# EAGLE schematic icyradio-exp-mmw-int (EAGLE 9.6.2)
CREVISION: 1; DESIGNER: Joao Silva; SERIES: ATC520L

## Sheet 1 of 11: MCU
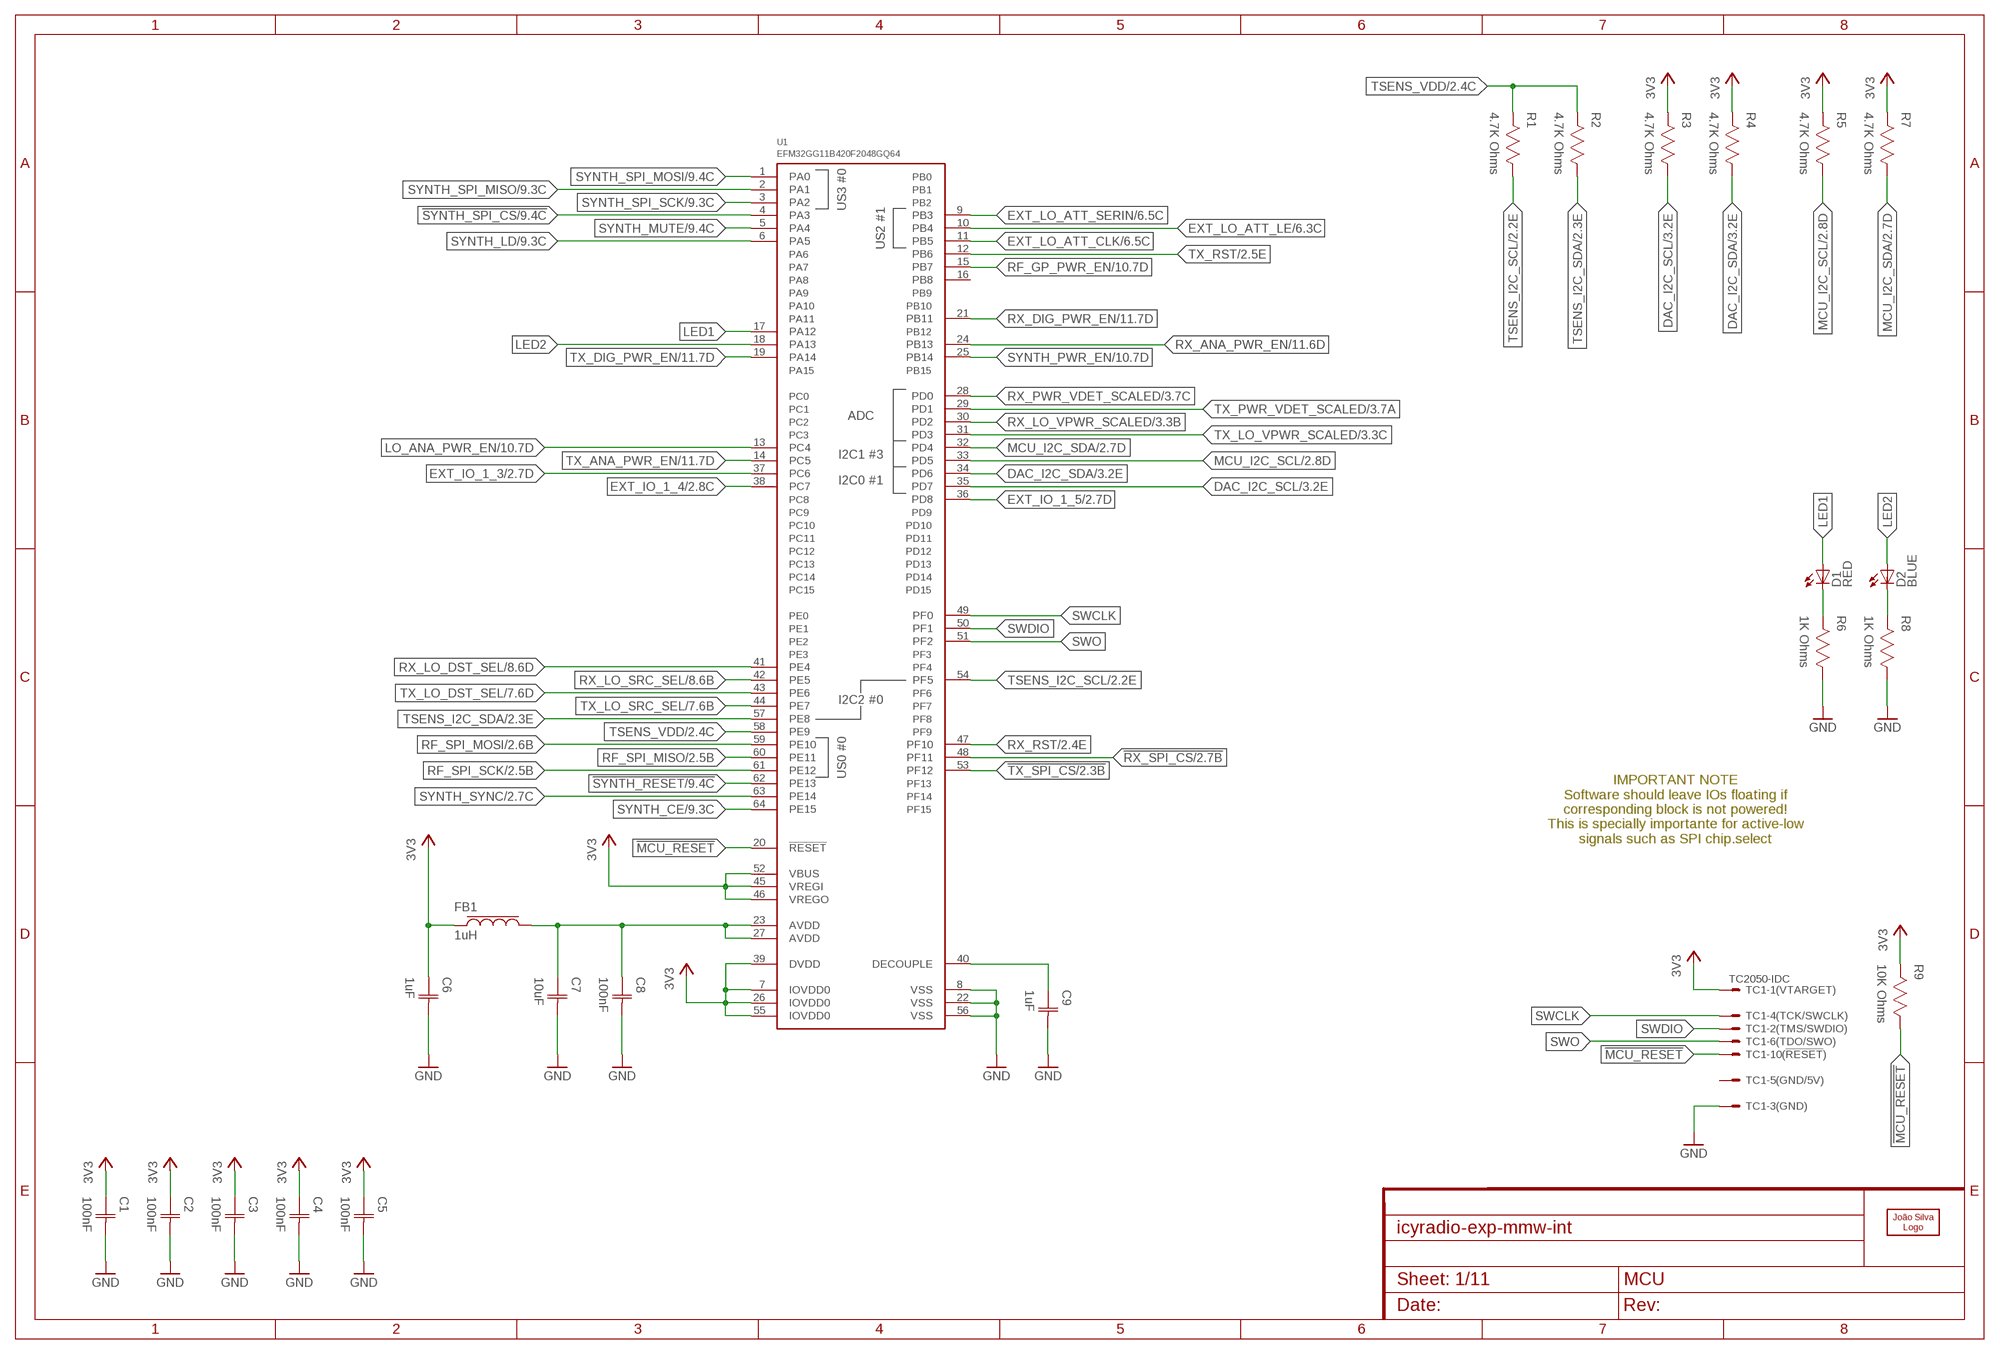
[diagram p0: schematic, sheet 1]

### Parts
C1  100nF  CAPACITOR-0402  [CAP0402]
C2  100nF  CAPACITOR-0402  [CAP0402]
C3  100nF  CAPACITOR-0402  [CAP0402]
C4  100nF  CAPACITOR-0402  [CAP0402]
C5  100nF  CAPACITOR-0402  [CAP0402]
C6  1uF  CAPACITOR-0402  [CAP0402]
C7  10uF  CAPACITOR-0402  [CAP0402]
C8  100nF  CAPACITOR-0402  [CAP0402]
C9  1uF  CAPACITOR-0402  [CAP0402]
D1  LED0603  [0603]
D2  LED0603  [0603]
FB1  1uH  FERRITE-0603  [IND0603]
LOGO1  JSILVA-5MM  [JSILVA_5MM]
R1  4.7K Ohms  RESISTOR-0402  [RES0402]
R2  4.7K Ohms  RESISTOR-0402  [RES0402]
R3  4.7K Ohms  RESISTOR-0402  [RES0402]
R4  4.7K Ohms  RESISTOR-0402  [RES0402]
R5  4.7K Ohms  RESISTOR-0402  [RES0402]
R6  1K Ohms  RESISTOR-0402  [RES0402]
R7  4.7K Ohms  RESISTOR-0402  [RES0402]
R8  1K Ohms  RESISTOR-0402  [RES0402]
R9  10K Ohms  RESISTOR-0402  [RES0402]
TC1  TC2050-IDC  [TC2050-IDC]
U1  EFM32GG11B420F2048GQ64  [QFP64]

### Nets
3V3: C1.1(C1) C2.1(C1) C3.1(C1) C4.1(C1) C5.1(C1) C6.1(C1) FB1.1 R3.2 R4.2 R5.2 R7.2 R9.2 TC1.1 U1.7(IOVDD0) U1.26(IOVDD0) U1.39(DVDD) U1.45(VREGI) U1.46(VREGO) U1.52(VBUS) U1.55(IOVDD0) ; also sheet 2,3,11
!MCU_RESET: R9.1 TC1.10 U1.20(!RESET)
!RX_SPI_CS: U1.48(PF11) ; also sheet 2
!SYNTH_RESET: U1.62(PE13) ; also sheet 9
!SYNTH_SPI_CS: U1.4(PA3) ; also sheet 9
!TX_SPI_CS: U1.53(PF12) ; also sheet 2
DAC_I2C_SCL: R3.1 U1.35(PD7) ; also sheet 3
DAC_I2C_SDA: R4.1 U1.34(PD6) ; also sheet 3
EXT_IO_1_3: U1.37(PC6) ; also sheet 2
EXT_IO_1_4: U1.38(PC7) ; also sheet 2
EXT_IO_1_5: U1.36(PD8) ; also sheet 2
EXT_LO_ATT_CLK: U1.11(PB5) ; also sheet 6
EXT_LO_ATT_LE: U1.10(PB4) ; also sheet 6
EXT_LO_ATT_SERIN: U1.9(PB3) ; also sheet 6
GND: C1.2(C2) C2.2(C2) C3.2(C2) C4.2(C2) C5.2(C2) C6.2(C2) C7.2(C2) C8.2(C2) C9.2(C2) R6.1 R8.1 TC1.3 U1.8(VSS) U1.22(VSS) U1.56(VSS) ; also sheet 2,3,4,5,6,7,8,9,10,11
LED1: D1.A U1.17(PA12)
LED2: D2.A U1.18(PA13)
LO_ANA_PWR_EN: U1.13(PC4) ; also sheet 10
MCU_AVDD: C7.1(C1) C8.1(C1) FB1.2 U1.23(AVDD) U1.27(AVDD)
MCU_I2C_SCL: R5.1 U1.33(PD5) ; also sheet 2
MCU_I2C_SDA: R7.1 U1.32(PD4) ; also sheet 2
N$1: C9.1(C1) U1.40(DECOUPLE)
N$7: D1.C R6.2
N$16: D2.C R8.2
RF_GP_PWR_EN: U1.15(PB7) ; also sheet 10
RF_SPI_MISO: U1.60(PE11) ; also sheet 2
RF_SPI_MOSI: U1.59(PE10) ; also sheet 2
RF_SPI_SCK: U1.61(PE12) ; also sheet 2
RX_ANA_PWR_EN: U1.24(PB13) ; also sheet 11
RX_DIG_PWR_EN: U1.21(PB11) ; also sheet 11
RX_LO_DST_SEL: U1.41(PE4) ; also sheet 8
RX_LO_SRC_SEL: U1.42(PE5) ; also sheet 8
RX_LO_VPWR_SCALED: U1.30(PD2) ; also sheet 3
RX_PWR_VDET_SCALED: U1.28(PD0) ; also sheet 3
RX_RST: U1.47(PF10) ; also sheet 2
SWCLK: TC1.4 U1.49(PF0)
SWDIO: TC1.2 U1.50(PF1)
SWO: TC1.6 U1.51(PF2)
SYNTH_CE: U1.64(PE15) ; also sheet 9
SYNTH_LD: U1.6(PA5) ; also sheet 9
SYNTH_MUTE: U1.5(PA4) ; also sheet 9
SYNTH_PWR_EN: U1.25(PB14) ; also sheet 10
SYNTH_SPI_MISO: U1.2(PA1) ; also sheet 9
SYNTH_SPI_MOSI: U1.1(PA0) ; also sheet 9
SYNTH_SPI_SCK: U1.3(PA2) ; also sheet 9
SYNTH_SYNC: U1.63(PE14) ; also sheet 2,9
TSENS_I2C_SCL: R1.1 U1.54(PF5) ; also sheet 2
TSENS_I2C_SDA: R2.1 U1.57(PE8) ; also sheet 2
TSENS_VDD: R1.2 R2.2 U1.58(PE9) ; also sheet 2
TX_ANA_PWR_EN: U1.14(PC5) ; also sheet 11
TX_DIG_PWR_EN: U1.19(PA14) ; also sheet 11
TX_LO_DST_SEL: U1.43(PE6) ; also sheet 7
TX_LO_SRC_SEL: U1.44(PE7) ; also sheet 7
TX_LO_VPWR_SCALED: U1.31(PD3) ; also sheet 3
TX_PWR_VDET_SCALED: U1.29(PD1) ; also sheet 3
TX_RST: U1.12(PB6) ; also sheet 2
Unconnected: TC1.5 TC1.7 TC1.8 TC1.9 U1.16(PB8)

### Notes on the sheet
- US3 #0
- US2 #1
- ADC
- I2C1 #3
- I2C0 #1
- I2C2 #0
- US0 #0
- IMPORTANT NOTE
  Software should leave IOs floating if
  corresponding block is not powered!
  This is specially importante for active-low
  signals such as SPI chip.select

## Sheet 2 of 11: Misc Digital
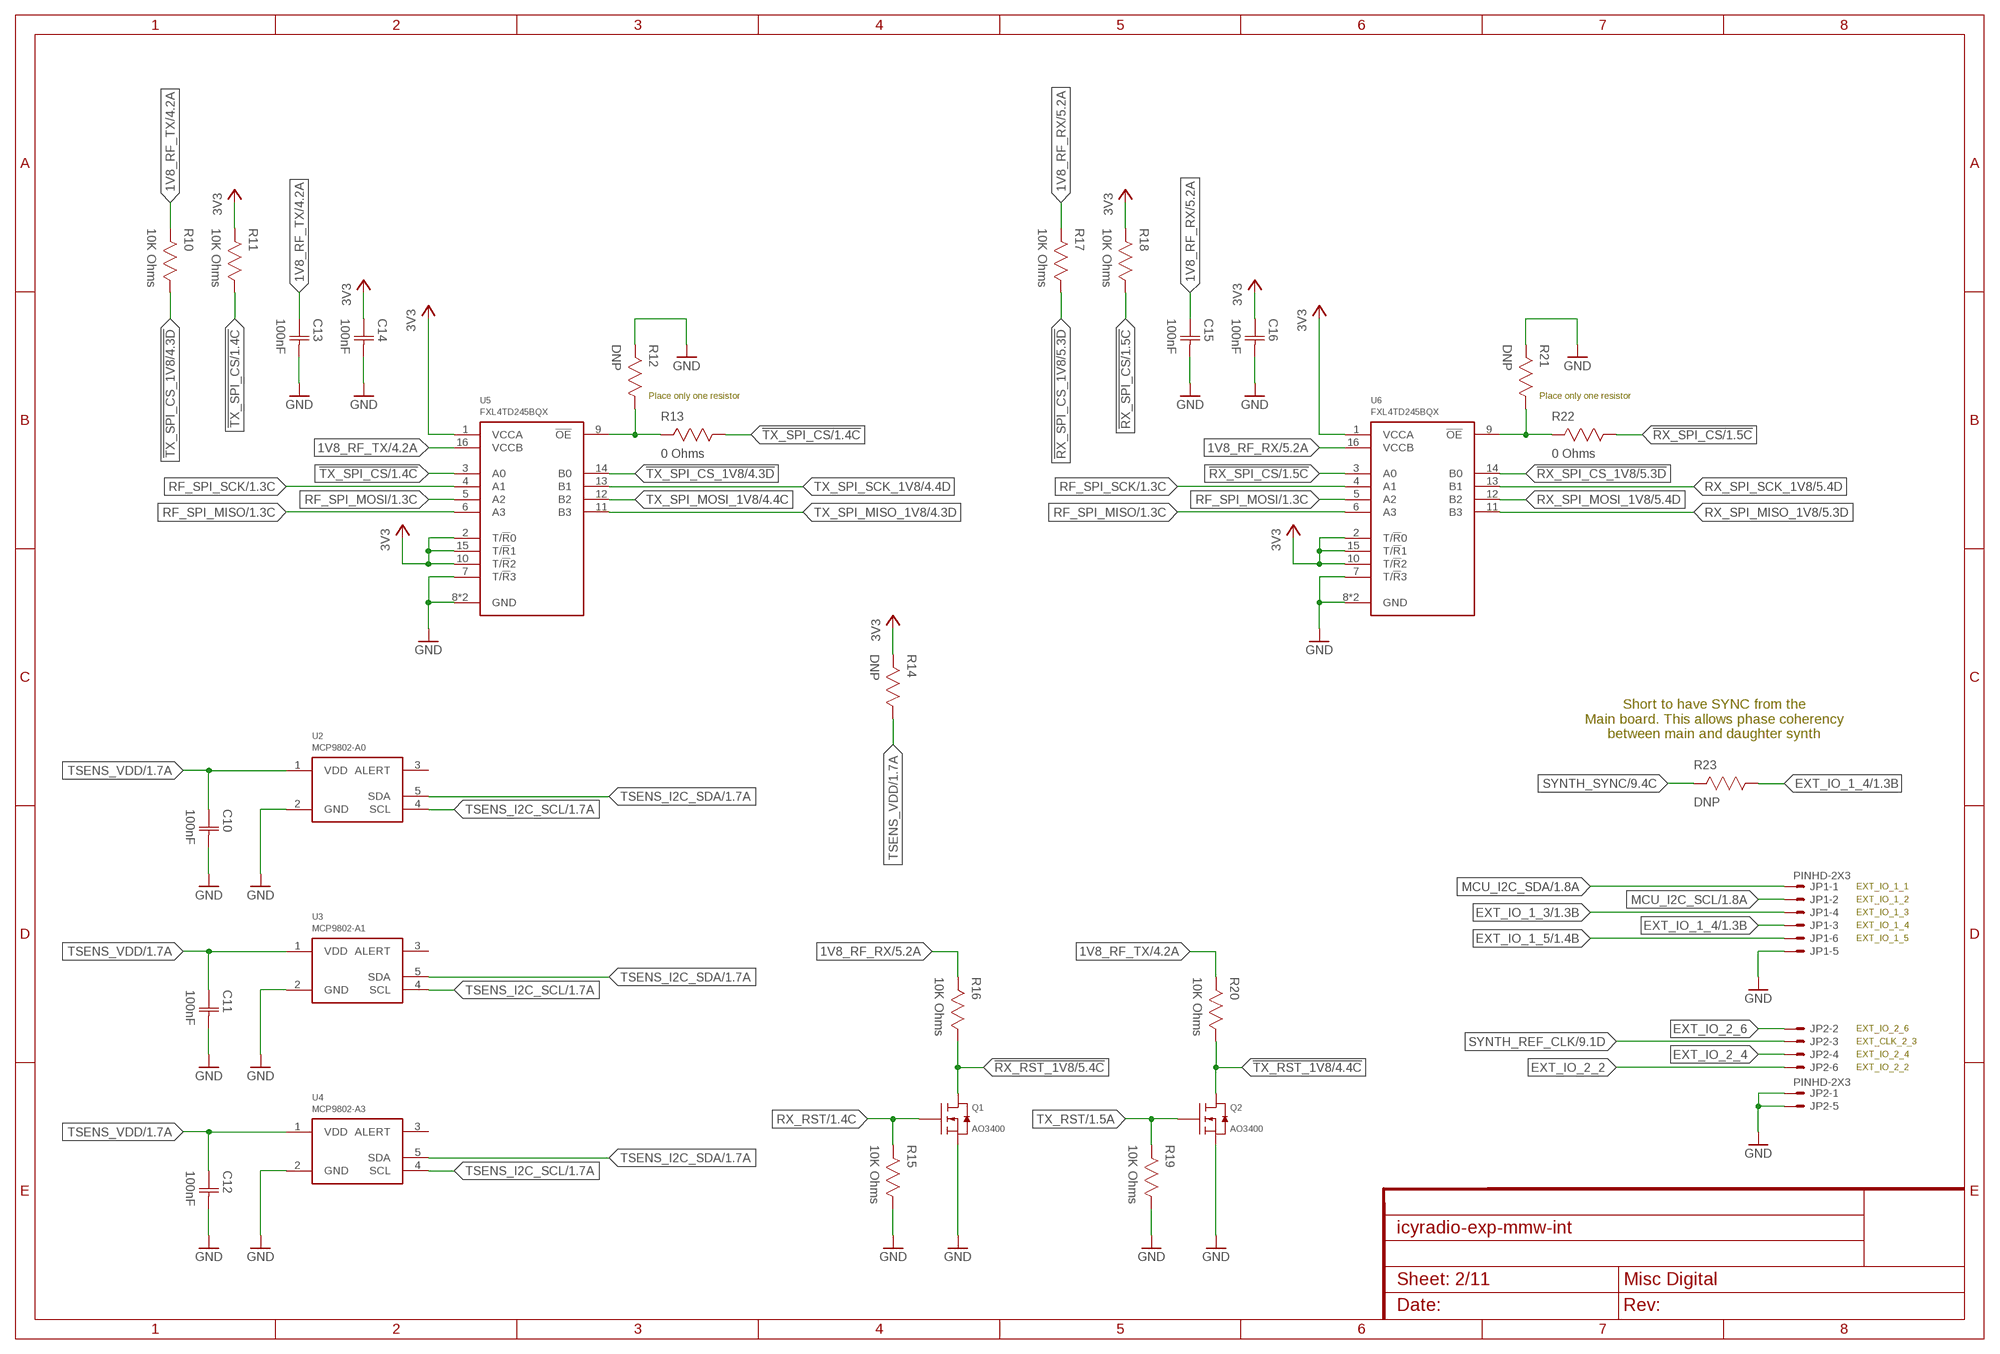
[diagram p1: schematic, sheet 2]

### Parts
C10  100nF  CAPACITOR-0402  [CAP0402]
C11  100nF  CAPACITOR-0402  [CAP0402]
C12  100nF  CAPACITOR-0402  [CAP0402]
C13  100nF  CAPACITOR-0402  [CAP0402]
C14  100nF  CAPACITOR-0402  [CAP0402]
C15  100nF  CAPACITOR-0402  [CAP0402]
C16  100nF  CAPACITOR-0402  [CAP0402]
JP1  PINHD-2X3  [2X03]
JP2  PINHD-2X3  [2X03]
Q1  AO3400  [SOT23]
Q2  AO3400  [SOT23]
R10  10K Ohms  RESISTOR-0402  [RES0402]
R11  10K Ohms  RESISTOR-0402  [RES0402]
R12  DNP  RESISTOR-0402  [RES0402]
R13  0 Ohms  RESISTOR-0402  [RES0402]
R14  DNP  RESISTOR-0402  [RES0402]
R15  10K Ohms  RESISTOR-0402  [RES0402]
R16  10K Ohms  RESISTOR-0402  [RES0402]
R17  10K Ohms  RESISTOR-0402  [RES0402]
R18  10K Ohms  RESISTOR-0402  [RES0402]
R19  10K Ohms  RESISTOR-0402  [RES0402]
R20  10K Ohms  RESISTOR-0402  [RES0402]
R21  DNP  RESISTOR-0402  [RES0402]
R22  0 Ohms  RESISTOR-0402  [RES0402]
R23  DNP  RESISTOR-0402  [RES0402]
U2  MCP9802-A0  [SOT23-5]
U3  MCP9802-A1  [SOT23-5]
U4  MCP9802-A3  [SOT23-5]
U5  FXL4TD245BQX  [DQFN16]
U6  FXL4TD245BQX  [DQFN16]

### Nets
1V8_RF_RX: C15.1(C1) R16.2 R17.2 U6.16(VCCB) ; also sheet 5,11
1V8_RF_TX: C13.1(C1) R10.2 R20.2 U5.16(VCCB) ; also sheet 4,11
3V3: C14.1(C1) C16.1(C1) R11.2 R14.2 R18.2 U5.1(VCCA) U5.2(T/!R!0) U5.10(T/!R!2) U5.15(T/!R!1) U6.1(VCCA) U6.2(T/!R!0) U6.10(T/!R!2) U6.15(T/!R!1) ; also sheet 1,3,11
!RX_RST_1V8: Q1.3(D) R16.1 ; also sheet 5
!RX_SPI_CS: R18.1 R22.1 U6.3(A0) ; also sheet 1
!RX_SPI_CS_1V8: R17.1 U6.14(B0) ; also sheet 5
!RX_SPI_OE: R21.1 R22.2 U6.9(!OE)
!TX_RST_1V8: Q2.3(D) R20.1 ; also sheet 4
!TX_SPI_CS: R11.1 R13.1 U5.3(A0) ; also sheet 1
!TX_SPI_CS_1V8: R10.1 U5.14(B0) ; also sheet 4
!TX_SPI_OE: R12.1 R13.2 U5.9(!OE)
EXT_IO_1_3: JP1.4 ; also sheet 1
EXT_IO_1_4: JP1.3 R23.1 ; also sheet 1
EXT_IO_1_5: JP1.6 ; also sheet 1
EXT_IO_2_2: JP2.6
EXT_IO_2_4: JP2.4
EXT_IO_2_6: JP2.2
GND: C10.2(C2) C11.2(C2) C12.2(C2) C13.2(C2) C14.2(C2) C15.2(C2) C16.2(C2) JP1.5 JP2.1 JP2.5 Q1.2(S) Q2.2(S) R12.2 R15.1 R19.1 R21.2 U2.2(GND) U3.2(GND) U4.2(GND) U5.7(T/!R!3) U5.8(GND) U5.17(GND) U6.7(T/!R!3) U6.8(GND) U6.17(GND) ; also sheet 1,3,4,5,6,7,8,9,10,11
MCU_I2C_SCL: JP1.2 ; also sheet 1
MCU_I2C_SDA: JP1.1 ; also sheet 1
RF_SPI_MISO: U5.6(A3) U6.6(A3) ; also sheet 1
RF_SPI_MOSI: U5.5(A2) U6.5(A2) ; also sheet 1
RF_SPI_SCK: U5.4(A1) U6.4(A1) ; also sheet 1
RX_RST: Q1.1(G) R15.2 ; also sheet 1
RX_SPI_MISO_1V8: U6.11(B3) ; also sheet 5
RX_SPI_MOSI_1V8: U6.12(B2) ; also sheet 5
RX_SPI_SCK_1V8: U6.13(B1) ; also sheet 5
SYNTH_REF_CLK: JP2.3 ; also sheet 9
SYNTH_SYNC: R23.2 ; also sheet 1,9
TSENS_I2C_SCL: U2.4(SCL) U3.4(SCL) U4.4(SCL) ; also sheet 1
TSENS_I2C_SDA: U2.5(SDA) U3.5(SDA) U4.5(SDA) ; also sheet 1
TSENS_VDD: C10.1(C1) C11.1(C1) C12.1(C1) R14.1 U2.1(VDD) U3.1(VDD) U4.1(VDD) ; also sheet 1
TX_RST: Q2.1(G) R19.2 ; also sheet 1
TX_SPI_MISO_1V8: U5.11(B3) ; also sheet 4
TX_SPI_MOSI_1V8: U5.12(B2) ; also sheet 4
TX_SPI_SCK_1V8: U5.13(B1) ; also sheet 4
Unconnected: U2.3(ALERT) U3.3(ALERT) U4.3(ALERT)

### Notes on the sheet
- Place only one resistor | Place only one resistor
- Short to have SYNC from the
  Main board. This allows phase coherency
  between main and daughter synth
- EXT_IO_1_1
- EXT_IO_1_2
- EXT_IO_1_3
- EXT_IO_1_4
- EXT_IO_1_5
- EXT_IO_2_6
- EXT_CLK_2_3
- EXT_IO_2_4
- EXT_IO_2_2

## Sheet 3 of 11: Misc Analog
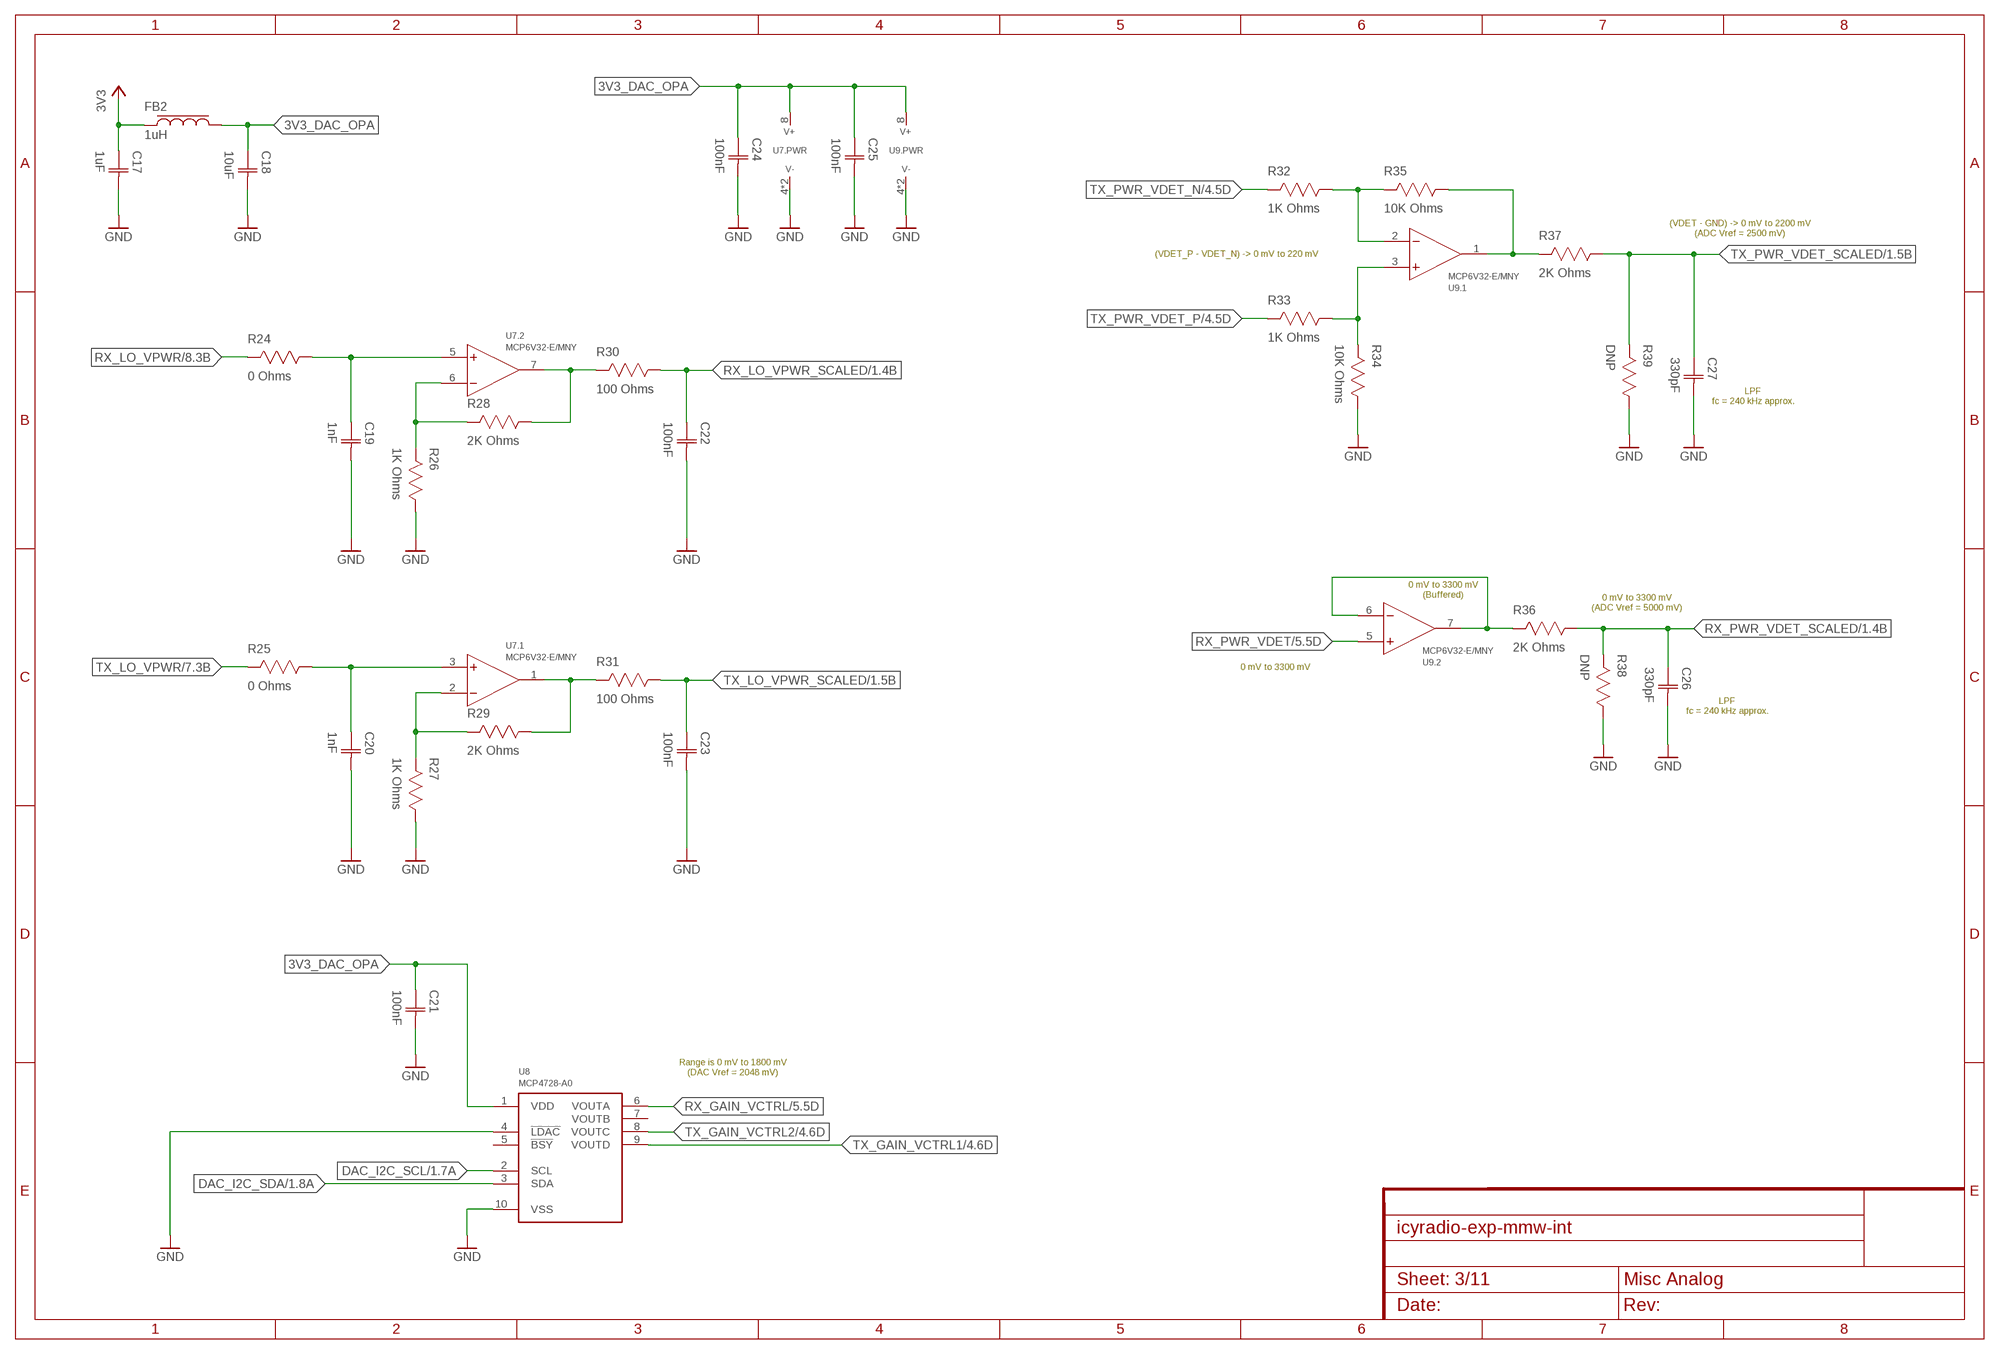
[diagram p2: schematic, sheet 3]

### Parts
C17  1uF  CAPACITOR-0402  [CAP0402]
C18  10uF  CAPACITOR-0402  [CAP0402]
C19  1nF  CAPACITOR-0402  [CAP0402]
C20  1nF  CAPACITOR-0402  [CAP0402]
C21  100nF  CAPACITOR-0402  [CAP0402]
C22  100nF  CAPACITOR-0402  [CAP0402]
C23  100nF  CAPACITOR-0402  [CAP0402]
C24  100nF  CAPACITOR-0402  [CAP0402]
C25  100nF  CAPACITOR-0402  [CAP0402]
C26  330pF  CAPACITOR-0402  [CAP0402]
C27  330pF  CAPACITOR-0402  [CAP0402]
FB2  1uH  FERRITE-0603  [IND0603]
R24  0 Ohms  RESISTOR-0402  [RES0402]
R25  0 Ohms  RESISTOR-0402  [RES0402]
R26  1K Ohms  RESISTOR-0402  [RES0402]
R27  1K Ohms  RESISTOR-0402  [RES0402]
R28  2K Ohms  RESISTOR-0402  [RES0402]
R29  2K Ohms  RESISTOR-0402  [RES0402]
R30  100 Ohms  RESISTOR-0402  [RES0402]
R31  100 Ohms  RESISTOR-0402  [RES0402]
R32  1K Ohms  RESISTOR-0402  [RES0402]
R33  1K Ohms  RESISTOR-0402  [RES0402]
R34  10K Ohms  RESISTOR-0402  [RES0402]
R35  10K Ohms  RESISTOR-0402  [RES0402]
R36  2K Ohms  RESISTOR-0402  [RES0402]
R37  2K Ohms  RESISTOR-0402  [RES0402]
R38  DNP  RESISTOR-0402  [RES0402]
R39  DNP  RESISTOR-0402  [RES0402]
U7  MCP6V32-E/MNY  [TDFN8]
U8  MCP4728-A0  [MSOP10]
U9  MCP6V32-E/MNY  [TDFN8]

### Nets
3V3: C17.1(C1) FB2.1 ; also sheet 1,2,11
3V3_DAC_OPA: C18.1(C1) C21.1(C1) C24.1(C1) C25.1(C1) FB2.2 U7.8(.PWR:V+) U8.1(VDD) U9.8(.PWR:V+)
DAC_I2C_SCL: U8.2(SCL) ; also sheet 1
DAC_I2C_SDA: U8.3(SDA) ; also sheet 1
GND: C17.2(C2) C18.2(C2) C19.2(C2) C20.2(C2) C21.2(C2) C22.2(C2) C23.2(C2) C24.2(C2) C25.2(C2) C26.2(C2) C27.2(C2) R26.1 R27.1 R34.1 R38.1 R39.1 U7.4(.PWR:V-) U7.9(.PWR:V-) U8.4(!LDAC) U8.10(VSS) U9.4(.PWR:V-) U9.9(.PWR:V-) ; also sheet 1,2,4,5,6,7,8,9,10,11
N$4: R32.1 R35.2 U9.2(.1:-IN)
N$5: R33.1 R34.2 U9.3(.1:+IN)
N$6: R36.2 U9.6(.2:-IN) U9.7(.2:OUT)
RX_GAIN_VCTRL: U8.6(VOUTA) ; also sheet 5
RX_LO_VPWR: R24.2 ; also sheet 8
RX_LO_VPWR_AMP: R28.1 R30.2 U7.7(.2:OUT)
RX_LO_VPWR_FB: R26.2 R28.2 U7.6(.2:-IN)
RX_LO_VPWR_FLT: C19.1(C1) R24.1 U7.5(.2:+IN)
RX_LO_VPWR_SCALED: C22.1(C1) R30.1 ; also sheet 1
RX_PWR_VDET: U9.5(.2:+IN) ; also sheet 5
RX_PWR_VDET_SCALED: C26.1(C1) R36.1 R38.2 ; also sheet 1
TX_GAIN_VCTRL1: U8.9(VOUTD) ; also sheet 4
TX_GAIN_VCTRL2: U8.8(VOUTC) ; also sheet 4
TX_LO_VPWR: R25.2 ; also sheet 7
TX_LO_VPWR_AMP: R29.1 R31.2 U7.1(.1:OUT)
TX_LO_VPWR_FB: R27.2 R29.2 U7.2(.1:-IN)
TX_LO_VPWR_FLT: C20.1(C1) R25.1 U7.3(.1:+IN)
TX_LO_VPWR_SCALED: C23.1(C1) R31.1 ; also sheet 1
TX_PWR_VDET: R35.1 R37.2 U9.1(.1:OUT)
TX_PWR_VDET_N [Microstrip Diff Z50]: R32.2 ; also sheet 4
TX_PWR_VDET_P [Microstrip Diff Z50]: R33.2 ; also sheet 4
TX_PWR_VDET_SCALED: C27.1(C1) R37.1 R39.2 ; also sheet 1
Unconnected: U8.5(!BSY) U8.7(VOUTB)

### Notes on the sheet
- (VDET - GND) -> 0 mV to 2200 mV
  (ADC Vref = 2500 mV)
- (VDET_P - VDET_N) -> 0 mV to 220 mV
- LPF
  fc = 240 kHz approx.
- 0 mV to 3300 mV
  (Buffered)
- 0 mV to 3300 mV
  (ADC Vref = 5000 mV)
- 0 mV to 3300 mV
- LPF
  fc = 240 kHz approx.
- Range is 0 mV to 1800 mV
  (DAC Vref = 2048 mV)

## Sheet 4 of 11: Upconverter
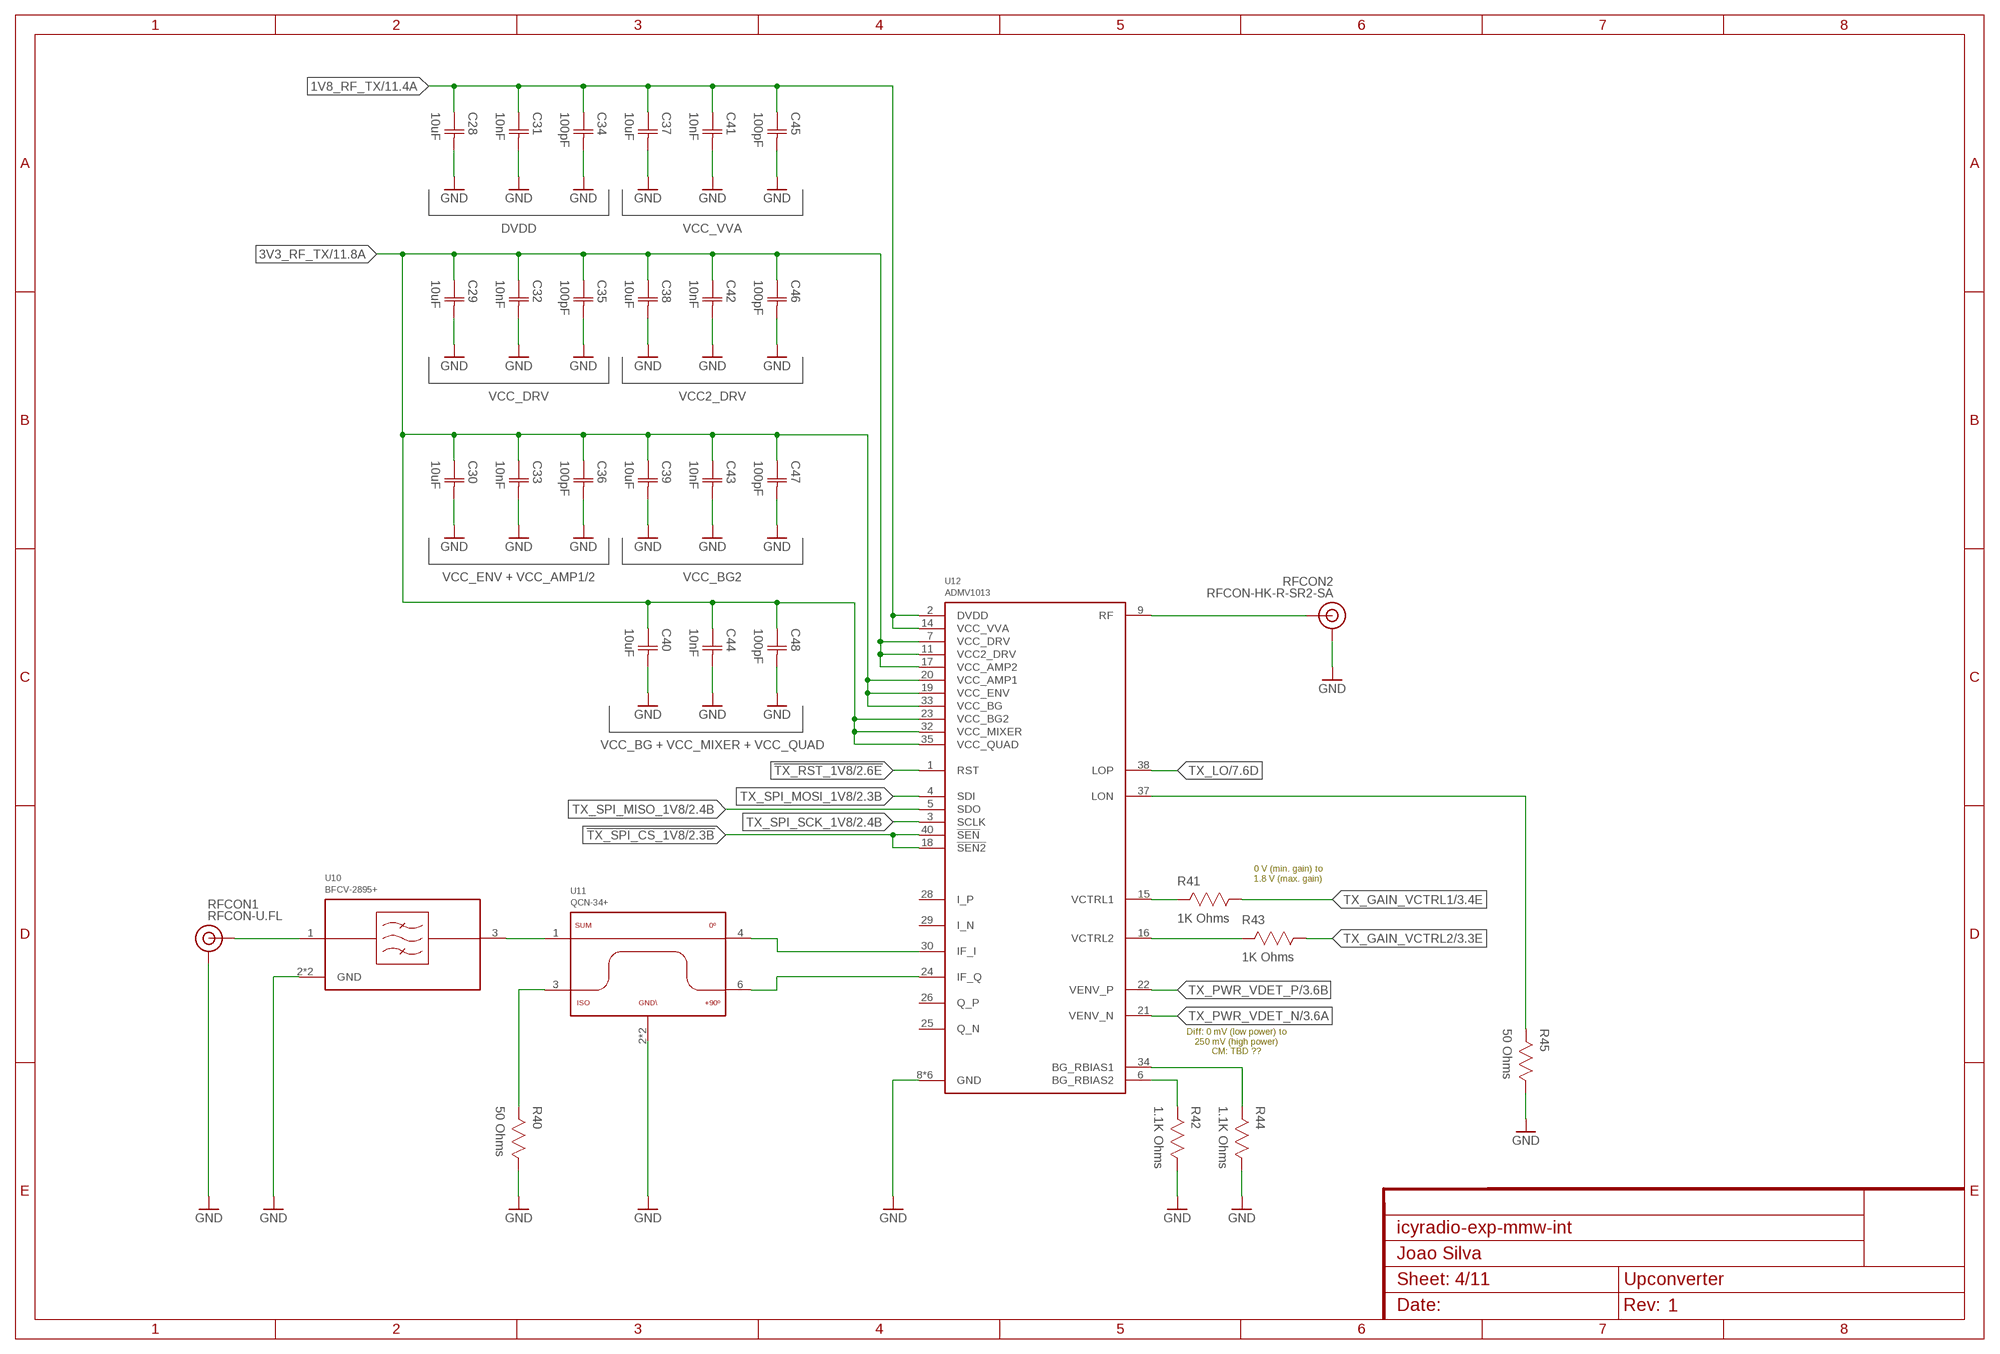
[diagram p3: schematic, sheet 4]

### Parts
C28  10uF  CAPACITOR-0402  [CAP0402]
C29  10uF  CAPACITOR-0402  [CAP0402]
C30  10uF  CAPACITOR-0402  [CAP0402]
C31  10nF  CAPACITOR-0402  [CAP0402]
C32  10nF  CAPACITOR-0402  [CAP0402]
C33  10nF  CAPACITOR-0402  [CAP0402]
C34  100pF  CAPACITOR-0402  [CAP0402]
C35  100pF  CAPACITOR-0402  [CAP0402]
C36  100pF  CAPACITOR-0402  [CAP0402]
C37  10uF  CAPACITOR-0402  [CAP0402]
C38  10uF  CAPACITOR-0402  [CAP0402]
C39  10uF  CAPACITOR-0402  [CAP0402]
C40  10uF  CAPACITOR-0402  [CAP0402]
C41  10nF  CAPACITOR-0402  [CAP0402]
C42  10nF  CAPACITOR-0402  [CAP0402]
C43  10nF  CAPACITOR-0402  [CAP0402]
C44  10nF  CAPACITOR-0402  [CAP0402]
C45  100pF  CAPACITOR-0402  [CAP0402]
C46  100pF  CAPACITOR-0402  [CAP0402]
C47  100pF  CAPACITOR-0402  [CAP0402]
C48  100pF  CAPACITOR-0402  [CAP0402]
R40  50 Ohms  RESISTOR-0402  [RES0402]
R41  1K Ohms  RESISTOR-0402  [RES0402]
R42  1.1K Ohms  RESISTOR-0402  [RES0402]
R43  1K Ohms  RESISTOR-0402  [RES0402]
R44  1.1K Ohms  RESISTOR-0402  [RES0402]
R45  50 Ohms  RESISTOR-0402  [RES0402]
RFCON1  RFCON-U.FL  [U.FL]
RFCON2  RFCON-HK-R-SR2-SA  [HK-R-SR2-SA]
U10  BFCV-2895+  [JV1210C]
U11  QCN-34+  [FV1206-1]
U12  ADMV1013  [LGA40]

### Nets
1V8_RF_TX: C28.1(C1) C31.1(C1) C34.1(C1) C37.1(C1) C41.1(C1) C45.1(C1) U12.2(DVDD) U12.14(VCC_VVA) ; also sheet 2,11
3V3_RF_TX: C29.1(C1) C30.1(C1) C32.1(C1) C33.1(C1) C35.1(C1) C36.1(C1) C38.1(C1) C39.1(C1) C40.1(C1) C42.1(C1) C43.1(C1) C44.1(C1) C46.1(C1) C47.1(C1) C48.1(C1) U12.7(VCC_DRV) U12.11(VCC2_DRV) U12.17(VCC_AMP2) U12.19(VCC_ENV) U12.20(VCC_AMP1) U12.23(VCC_BG2) U12.32(VCC_MIXER) U12.33(VCC_BG) U12.35(VCC_QUAD) ; also sheet 11
!TX_RST_1V8: U12.1(RST) ; also sheet 2
!TX_SPI_CS_1V8: U12.18(!SEN2) U12.40(!SEN) ; also sheet 2
GND: C28.2(C2) C29.2(C2) C30.2(C2) C31.2(C2) C32.2(C2) C33.2(C2) C34.2(C2) C35.2(C2) C36.2(C2) C37.2(C2) C38.2(C2) C39.2(C2) C40.2(C2) C41.2(C2) C42.2(C2) C43.2(C2) C44.2(C2) C45.2(C2) C46.2(C2) C47.2(C2) C48.2(C2) R40.1 R42.1 R44.1 R45.1 RFCON1.P$1(GND) RFCON1.P$2(GND) RFCON2.GND@1(GND) RFCON2.GND@2(GND) U10.2(GND) U10.4(GND) U11.2(GND) U11.5(GND) U12.8(GND) U12.10(GND) U12.27(GND) U12.36(GND) U12.39(GND) U12.41(GND) ; also sheet 1,2,3,5,6,7,8,9,10,11
N$17: R42.2 U12.6(BG_RBIAS2)
N$18: R44.2 U12.34(BG_RBIAS1)
N$19: R40.2 U11.3(ISO)
N$20: R41.2 U12.15(VCTRL1)
N$21: R43.2 U12.16(VCTRL2)
TX_GAIN_VCTRL1: R41.1 ; also sheet 3
TX_GAIN_VCTRL2: R43.1 ; also sheet 3
TX_IF_FILT: U10.3(RFOUT) U11.1(SUM)
TX_IF_I: U11.4(0DEG) U12.30(IF_I)
TX_IF_IN: RFCON1.P$3(SIGNAL) U10.1(RFIN)
TX_IF_Q: U11.6(P90DEG) U12.24(IF_Q)
TX_LO: U12.38(LOP) ; also sheet 7
TX_LO_N: R45.2 U12.37(LON)
TX_PWR_VDET_N [Microstrip Diff Z50]: U12.21(VENV_N) ; also sheet 3
TX_PWR_VDET_P [Microstrip Diff Z50]: U12.22(VENV_P) ; also sheet 3
TX_RF: RFCON2.SIG(SIGNAL) U12.9(RF)
TX_SPI_MISO_1V8: U12.5(SDO) ; also sheet 2
TX_SPI_MOSI_1V8: U12.4(SDI) ; also sheet 2
TX_SPI_SCK_1V8: U12.3(SCLK) ; also sheet 2
Unconnected: U12.25(Q_N) U12.26(Q_P) U12.28(I_P) U12.29(I_N)

### Notes on the sheet
- DVDD | VCC_VVA
- VCC_DRV | VCC2_DRV
- VCC_ENV + VCC_AMP1/2 | VCC_BG2
- VCC_BG + VCC_MIXER + VCC_QUAD
- 0 V (min. gain) to
  1.8 V (max. gain)
- Diff: 0 mV (low power) to
  250 mV (high power)
  CM: TBD ??

## Sheet 5 of 11: Downconverter
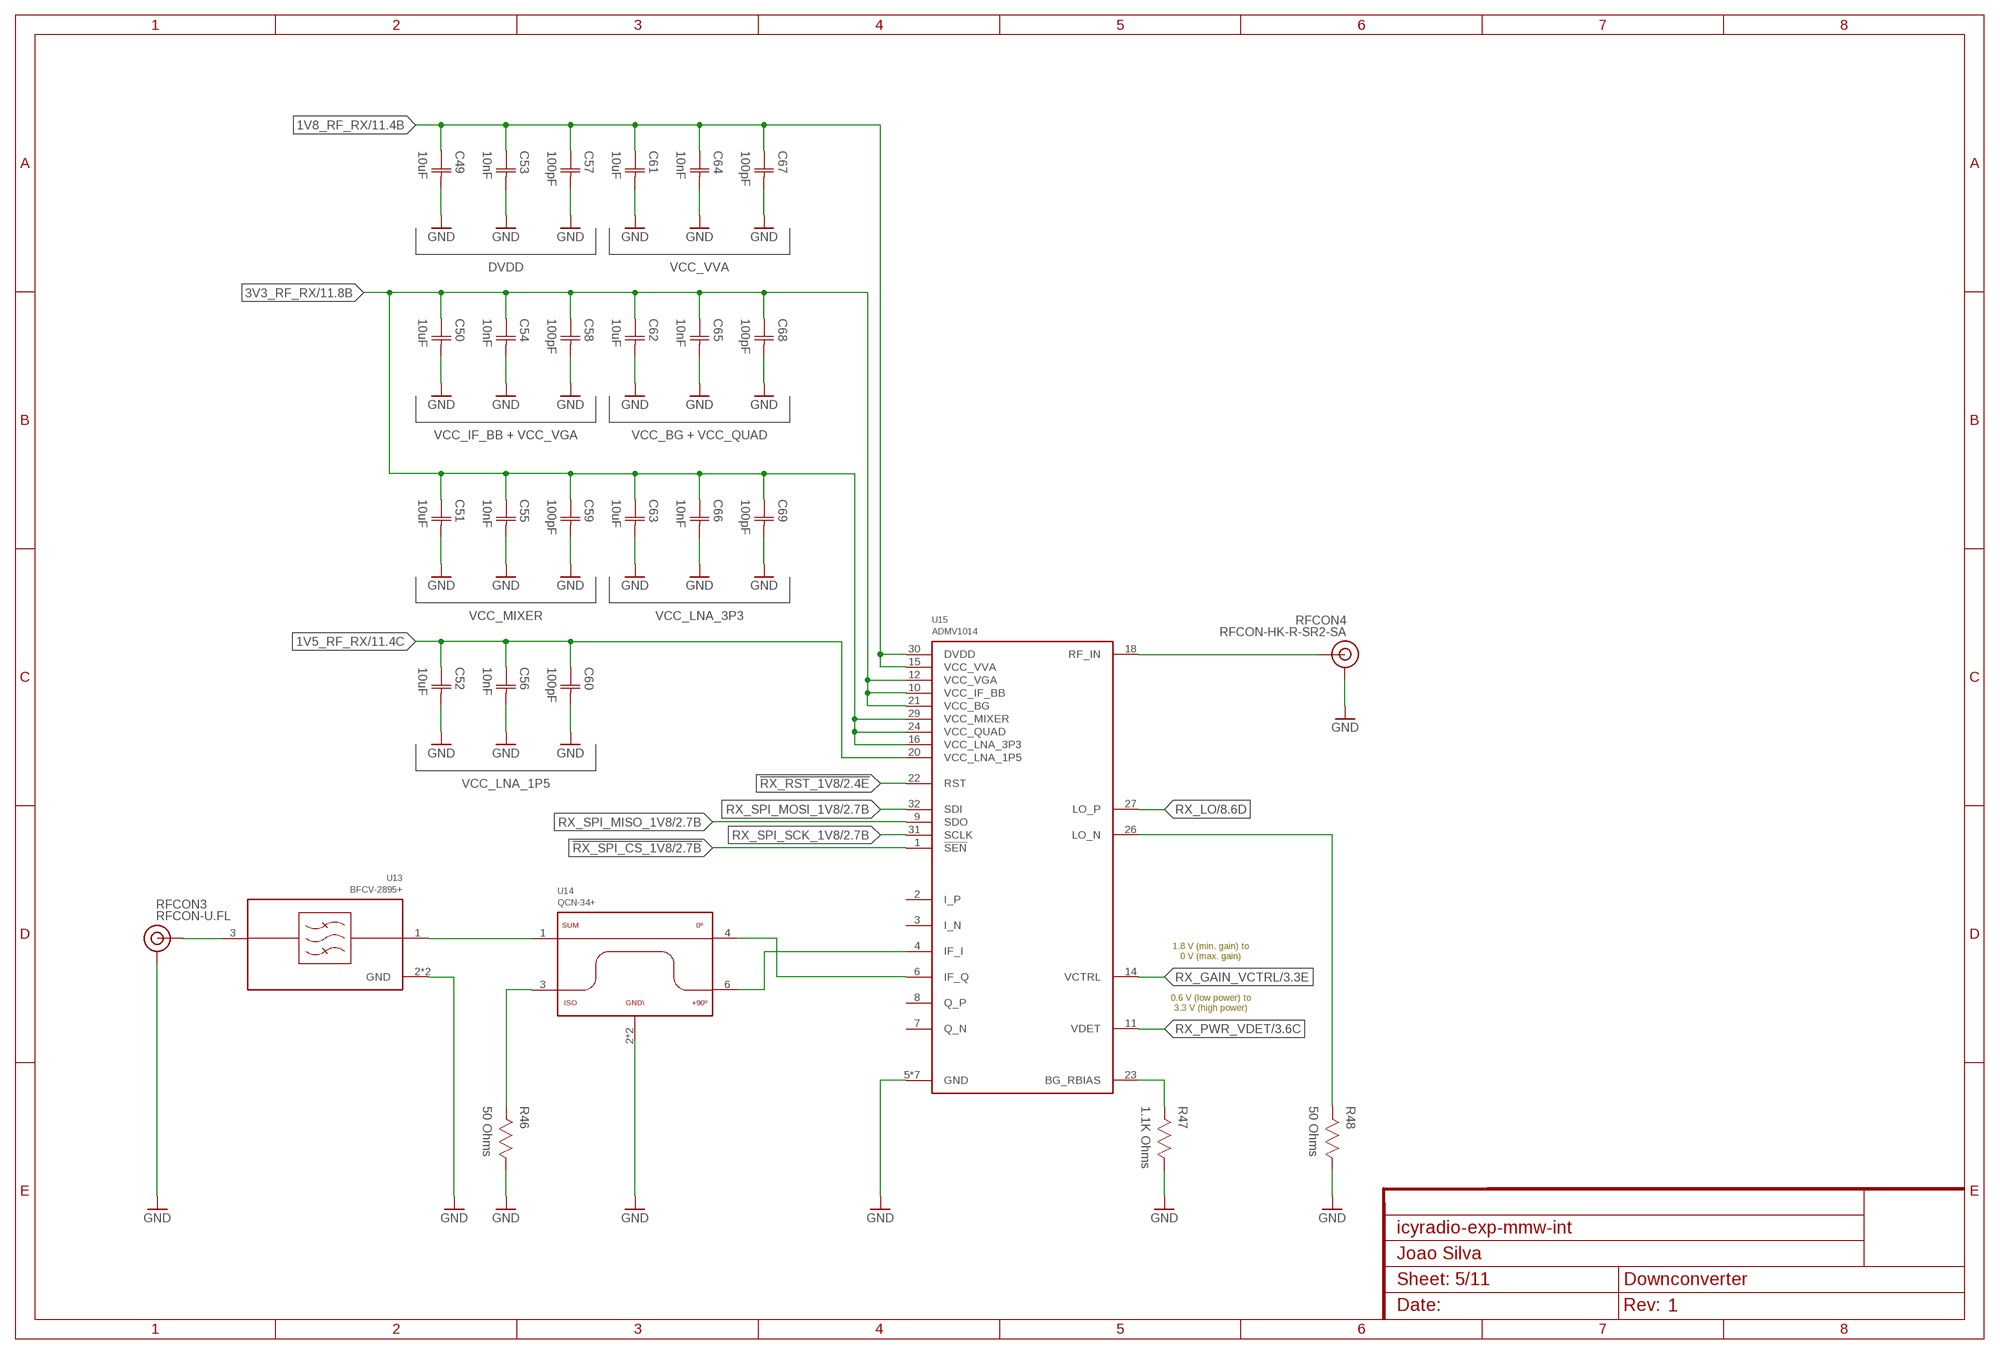
[diagram p4: schematic, sheet 5]

### Parts
C49  10uF  CAPACITOR-0402  [CAP0402]
C50  10uF  CAPACITOR-0402  [CAP0402]
C51  10uF  CAPACITOR-0402  [CAP0402]
C52  10uF  CAPACITOR-0402  [CAP0402]
C53  10nF  CAPACITOR-0402  [CAP0402]
C54  10nF  CAPACITOR-0402  [CAP0402]
C55  10nF  CAPACITOR-0402  [CAP0402]
C56  10nF  CAPACITOR-0402  [CAP0402]
C57  100pF  CAPACITOR-0402  [CAP0402]
C58  100pF  CAPACITOR-0402  [CAP0402]
C59  100pF  CAPACITOR-0402  [CAP0402]
C60  100pF  CAPACITOR-0402  [CAP0402]
C61  10uF  CAPACITOR-0402  [CAP0402]
C62  10uF  CAPACITOR-0402  [CAP0402]
C63  10uF  CAPACITOR-0402  [CAP0402]
C64  10nF  CAPACITOR-0402  [CAP0402]
C65  10nF  CAPACITOR-0402  [CAP0402]
C66  10nF  CAPACITOR-0402  [CAP0402]
C67  100pF  CAPACITOR-0402  [CAP0402]
C68  100pF  CAPACITOR-0402  [CAP0402]
C69  100pF  CAPACITOR-0402  [CAP0402]
R46  50 Ohms  RESISTOR-0402  [RES0402]
R47  1.1K Ohms  RESISTOR-0402  [RES0402]
R48  50 Ohms  RESISTOR-0402  [RES0402]
RFCON3  RFCON-U.FL  [U.FL]
RFCON4  RFCON-HK-R-SR2-SA  [HK-R-SR2-SA]
U13  BFCV-2895+  [JV1210C]
U14  QCN-34+  [FV1206-1]
U15  ADMV1014  [LGA32]

### Nets
1V5_RF_RX: C52.1(C1) C56.1(C1) C60.1(C1) U15.20(VCC_LNA_1P5) ; also sheet 11
1V8_RF_RX: C49.1(C1) C53.1(C1) C57.1(C1) C61.1(C1) C64.1(C1) C67.1(C1) U15.15(VCC_VVA) U15.30(DVDD) ; also sheet 2,11
3V3_RF_RX: C50.1(C1) C51.1(C1) C54.1(C1) C55.1(C1) C58.1(C1) C59.1(C1) C62.1(C1) C63.1(C1) C65.1(C1) C66.1(C1) C68.1(C1) C69.1(C1) U15.10(VCC_IF_BB) U15.12(VCC_VGA) U15.16(VCC_LNA_3P3) U15.21(VCC_BG) U15.24(VCC_QUAD) U15.29(VCC_MIXER) ; also sheet 11
!RX_RST_1V8: U15.22(RST) ; also sheet 2
!RX_SPI_CS_1V8: U15.1(!SEN) ; also sheet 2
GND: C49.2(C2) C50.2(C2) C51.2(C2) C52.2(C2) C53.2(C2) C54.2(C2) C55.2(C2) C56.2(C2) C57.2(C2) C58.2(C2) C59.2(C2) C60.2(C2) C61.2(C2) C62.2(C2) C63.2(C2) C64.2(C2) C65.2(C2) C66.2(C2) C67.2(C2) C68.2(C2) C69.2(C2) R46.1 R47.1 R48.1 RFCON3.P$1(GND) RFCON3.P$2(GND) RFCON4.GND@1(GND) RFCON4.GND@2(GND) U13.2(GND) U13.4(GND) U14.2(GND) U14.5(GND) U15.5(GND) U15.13(GND) U15.17(GND) U15.19(GND) U15.25(GND) U15.28(GND) U15.33(GND) ; also sheet 1,2,3,4,6,7,8,9,10,11
N$22: R47.2 U15.23(BG_RBIAS)
N$23: R46.2 U14.3(ISO)
RX_GAIN_VCTRL: U15.14(VCTRL) ; also sheet 3
RX_IF: U13.1(RFIN) U14.1(SUM)
RX_IF_FILT: RFCON3.P$3(SIGNAL) U13.3(RFOUT)
RX_IF_I: U14.6(P90DEG) U15.4(IF_I)
RX_IF_Q: U14.4(0DEG) U15.6(IF_Q)
RX_LO: U15.27(LO_P) ; also sheet 8
RX_LO_N: R48.2 U15.26(LO_N)
RX_PWR_VDET: U15.11(VDET) ; also sheet 3
RX_RF: RFCON4.SIG(SIGNAL) U15.18(RF_IN)
RX_SPI_MISO_1V8: U15.9(SDO) ; also sheet 2
RX_SPI_MOSI_1V8: U15.32(SDI) ; also sheet 2
RX_SPI_SCK_1V8: U15.31(SCLK) ; also sheet 2
Unconnected: U15.2(I_P) U15.3(I_N) U15.7(Q_N) U15.8(Q_P)

### Notes on the sheet
- DVDD | VCC_VVA
- VCC_IF_BB + VCC_VGA | VCC_BG + VCC_QUAD
- VCC_MIXER | VCC_LNA_3P3
- VCC_LNA_1P5
- 1.8 V (min. gain) to
  0 V (max. gain)
- 0.6 V (low power) to
  3.3 V (high power)

## Sheet 6 of 11: External LO Conditioning
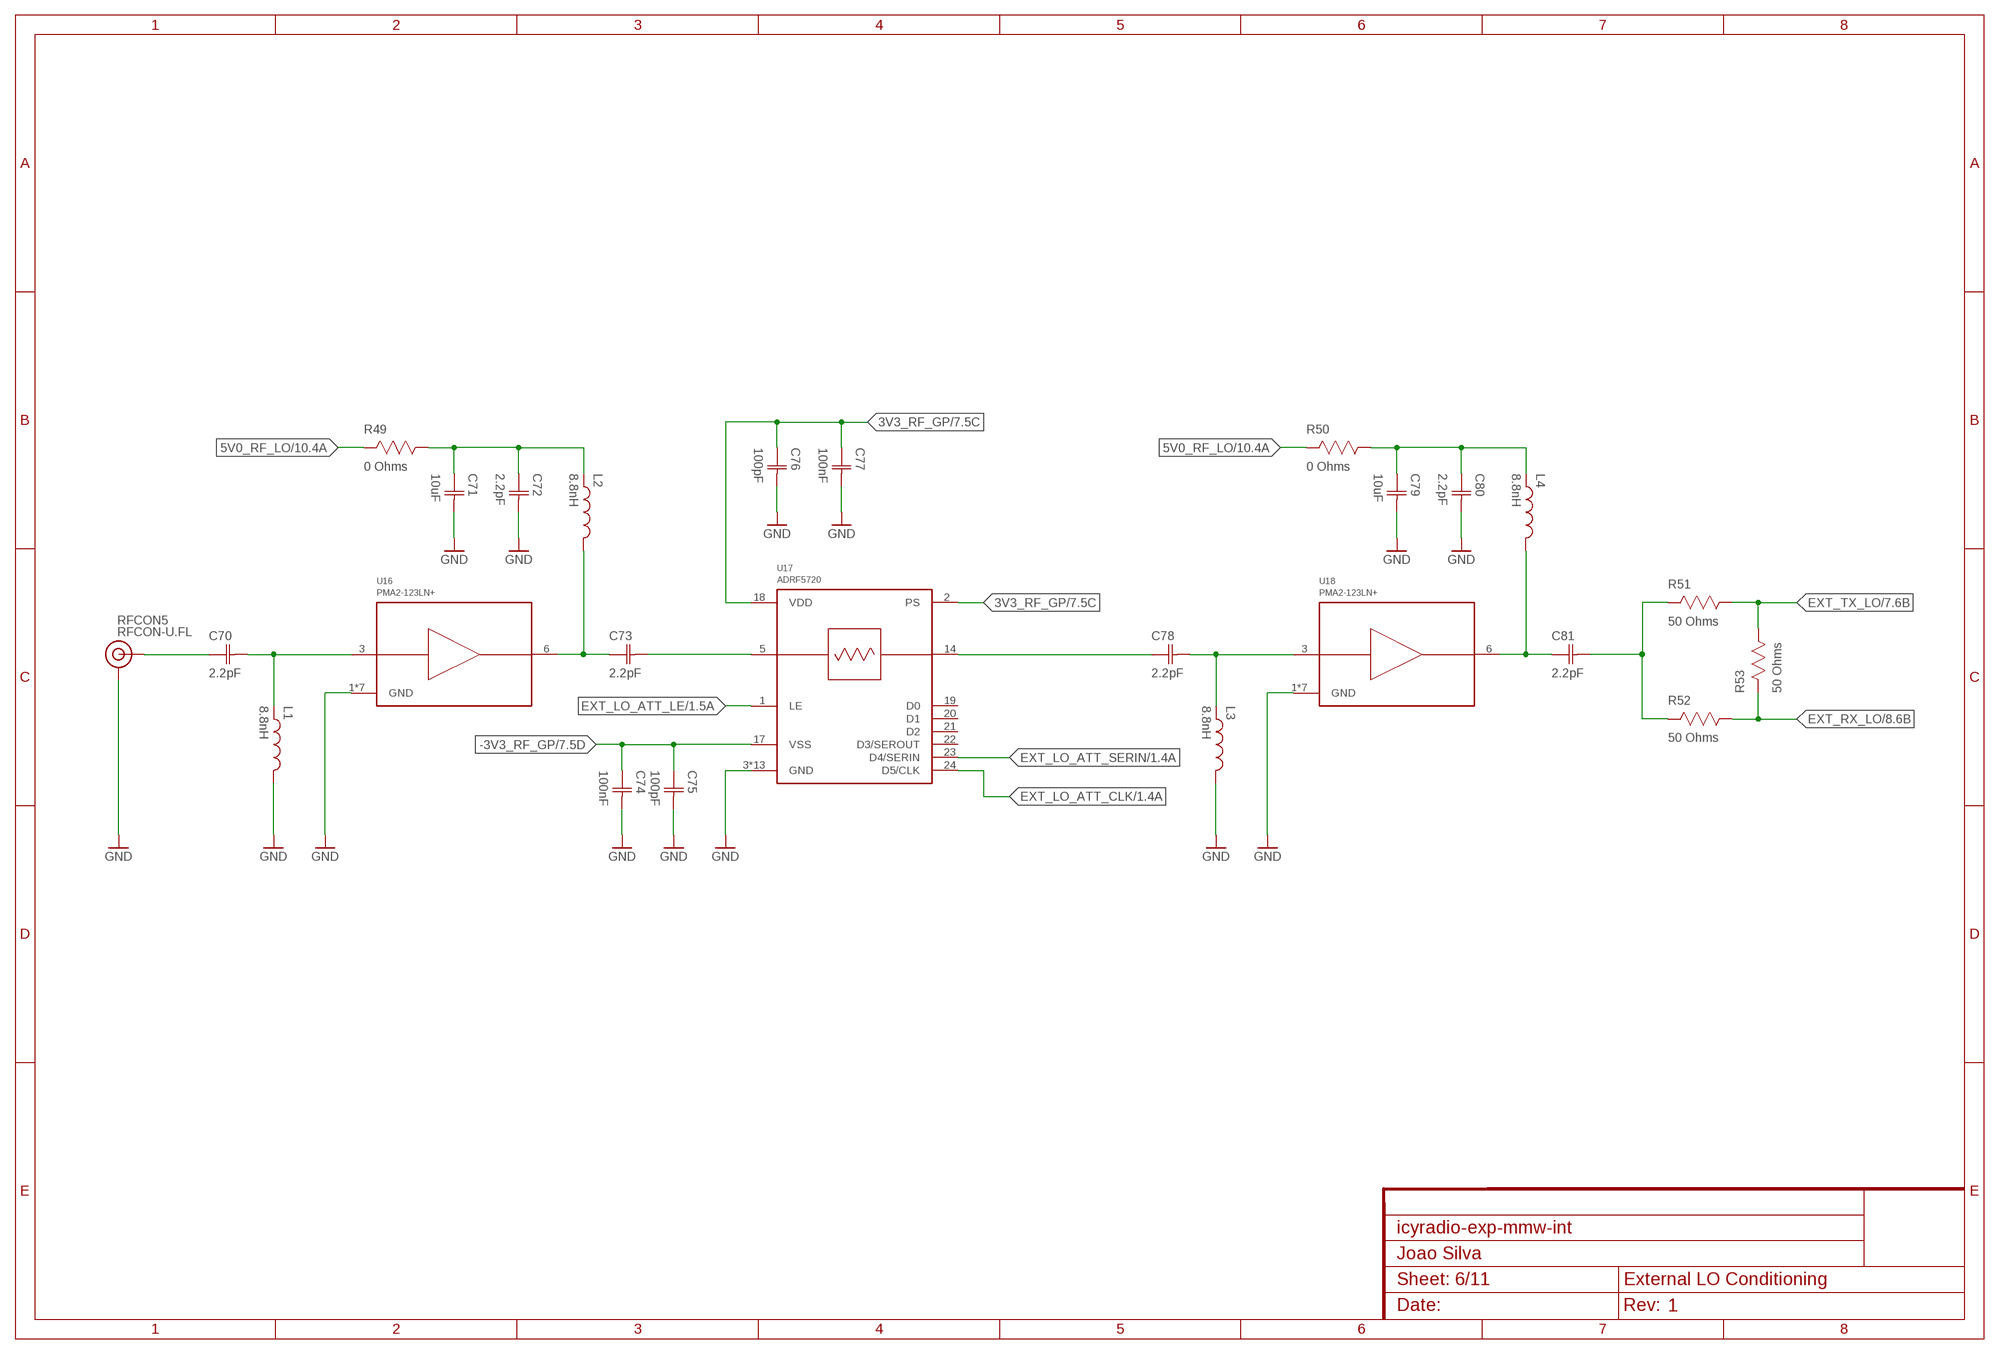
[diagram p5: schematic, sheet 6]

### Parts
C70  2.2pF  CAPACITOR-0402  [CAP0402]
C71  10uF  CAPACITOR-0402  [CAP0402]
C72  2.2pF  CAPACITOR-0402  [CAP0402]
C73  2.2pF  CAPACITOR-0402  [CAP0402]
C74  100nF  CAPACITOR-0402  [CAP0402]
C75  100pF  CAPACITOR-0402  [CAP0402]
C76  100pF  CAPACITOR-0402  [CAP0402]
C77  100nF  CAPACITOR-0402  [CAP0402]
C78  2.2pF  CAPACITOR-0402  [CAP0402]
C79  10uF  CAPACITOR-0402  [CAP0402]
C80  2.2pF  CAPACITOR-0402  [CAP0402]
C81  2.2pF  CAPACITOR-0402  [CAP0402]
L1  8.8nH  INDUCTOR-0402  [IND0402]
L2  8.8nH  INDUCTOR-0402  [IND0402]
L3  8.8nH  INDUCTOR-0402  [IND0402]
L4  8.8nH  INDUCTOR-0402  [IND0402]
R49  0 Ohms  RESISTOR-0402  [RES0402]
R50  0 Ohms  RESISTOR-0402  [RES0402]
R51  50 Ohms  RESISTOR-0402  [RES0402]
R52  50 Ohms  RESISTOR-0402  [RES0402]
R53  50 Ohms  RESISTOR-0402  [RES0402]
RFCON5  RFCON-U.FL  [U.FL]
U16  PMA2-123LN+  [MC1631-1]
U17  ADRF5720  [LGA24]
U18  PMA2-123LN+  [MC1631-1]

### Nets
3V3_RF_GP: C76.1(C1) C77.1(C1) U17.2(PS) U17.18(VDD) ; also sheet 7,8,10
5V0_RF_LO: R49.2 R50.2 ; also sheet 10
-3V3_RF_GP: C74.1(C1) C75.1(C1) U17.17(VSS) ; also sheet 7,8,10
EXT_LO_AMP1_IN: C70.2(C2) L1.1 U16.3(RFIN)
EXT_LO_AMP1_OUT: C73.1(C1) L2.2 U16.6(RFOUT)
EXT_LO_AMP1_VDD: C71.1(C1) C72.1(C1) L2.1 R49.1
EXT_LO_AMP2_IN: C78.2(C2) L3.1 U18.3(RFIN)
EXT_LO_AMP2_OUT: C81.1(C1) L4.2 U18.6(RFOUT)
EXT_LO_AMP2_VDD: C79.1(C1) C80.1(C1) L4.1 R50.1
EXT_LO_ATT_CLK: U17.24(D5/CLK) ; also sheet 1
EXT_LO_ATT_IN: C73.2(C2) U17.5(ATTIN)
EXT_LO_ATT_LE: U17.1(LE) ; also sheet 1
EXT_LO_ATT_OUT: C78.1(C1) U17.14(ATTOUT)
EXT_LO_ATT_SERIN: U17.23(D4/SERIN) ; also sheet 1
EXT_LO_DIV_IN: C81.2(C2) R51.2 R52.2
EXT_LO_IN: C70.1(C1) RFCON5.P$3(SIGNAL)
EXT_RX_LO: R52.1 R53.2 ; also sheet 8
EXT_TX_LO: R51.1 R53.1 ; also sheet 7
GND: C71.2(C2) C72.2(C2) C74.2(C2) C75.2(C2) C76.2(C2) C77.2(C2) C79.2(C2) C80.2(C2) L1.2 L3.2 RFCON5.P$1(GND) RFCON5.P$2(GND) U16.1(GND) U16.2(GND) U16.4(GND) U16.5(GND) U16.7(GND) U16.8(GND) U16.9(GND) U17.3(GND) U17.4(GND) U17.6(GND) U17.7(GND) U17.8(GND) U17.9(GND) U17.10(GND) U17.11(GND) U17.12(GND) U17.13(GND) U17.15(GND) U17.16(GND) U17.25(GND) U18.1(GND) U18.2(GND) U18.4(GND) U18.5(GND) U18.7(GND) U18.8(GND) U18.9(GND) ; also sheet 1,2,3,4,5,7,8,9,10,11
Unconnected: U17.19(D0) U17.20(D1) U17.21(D2) U17.22(D3/SEROUT)

## Sheet 7 of 11: TX LO Selection & Level
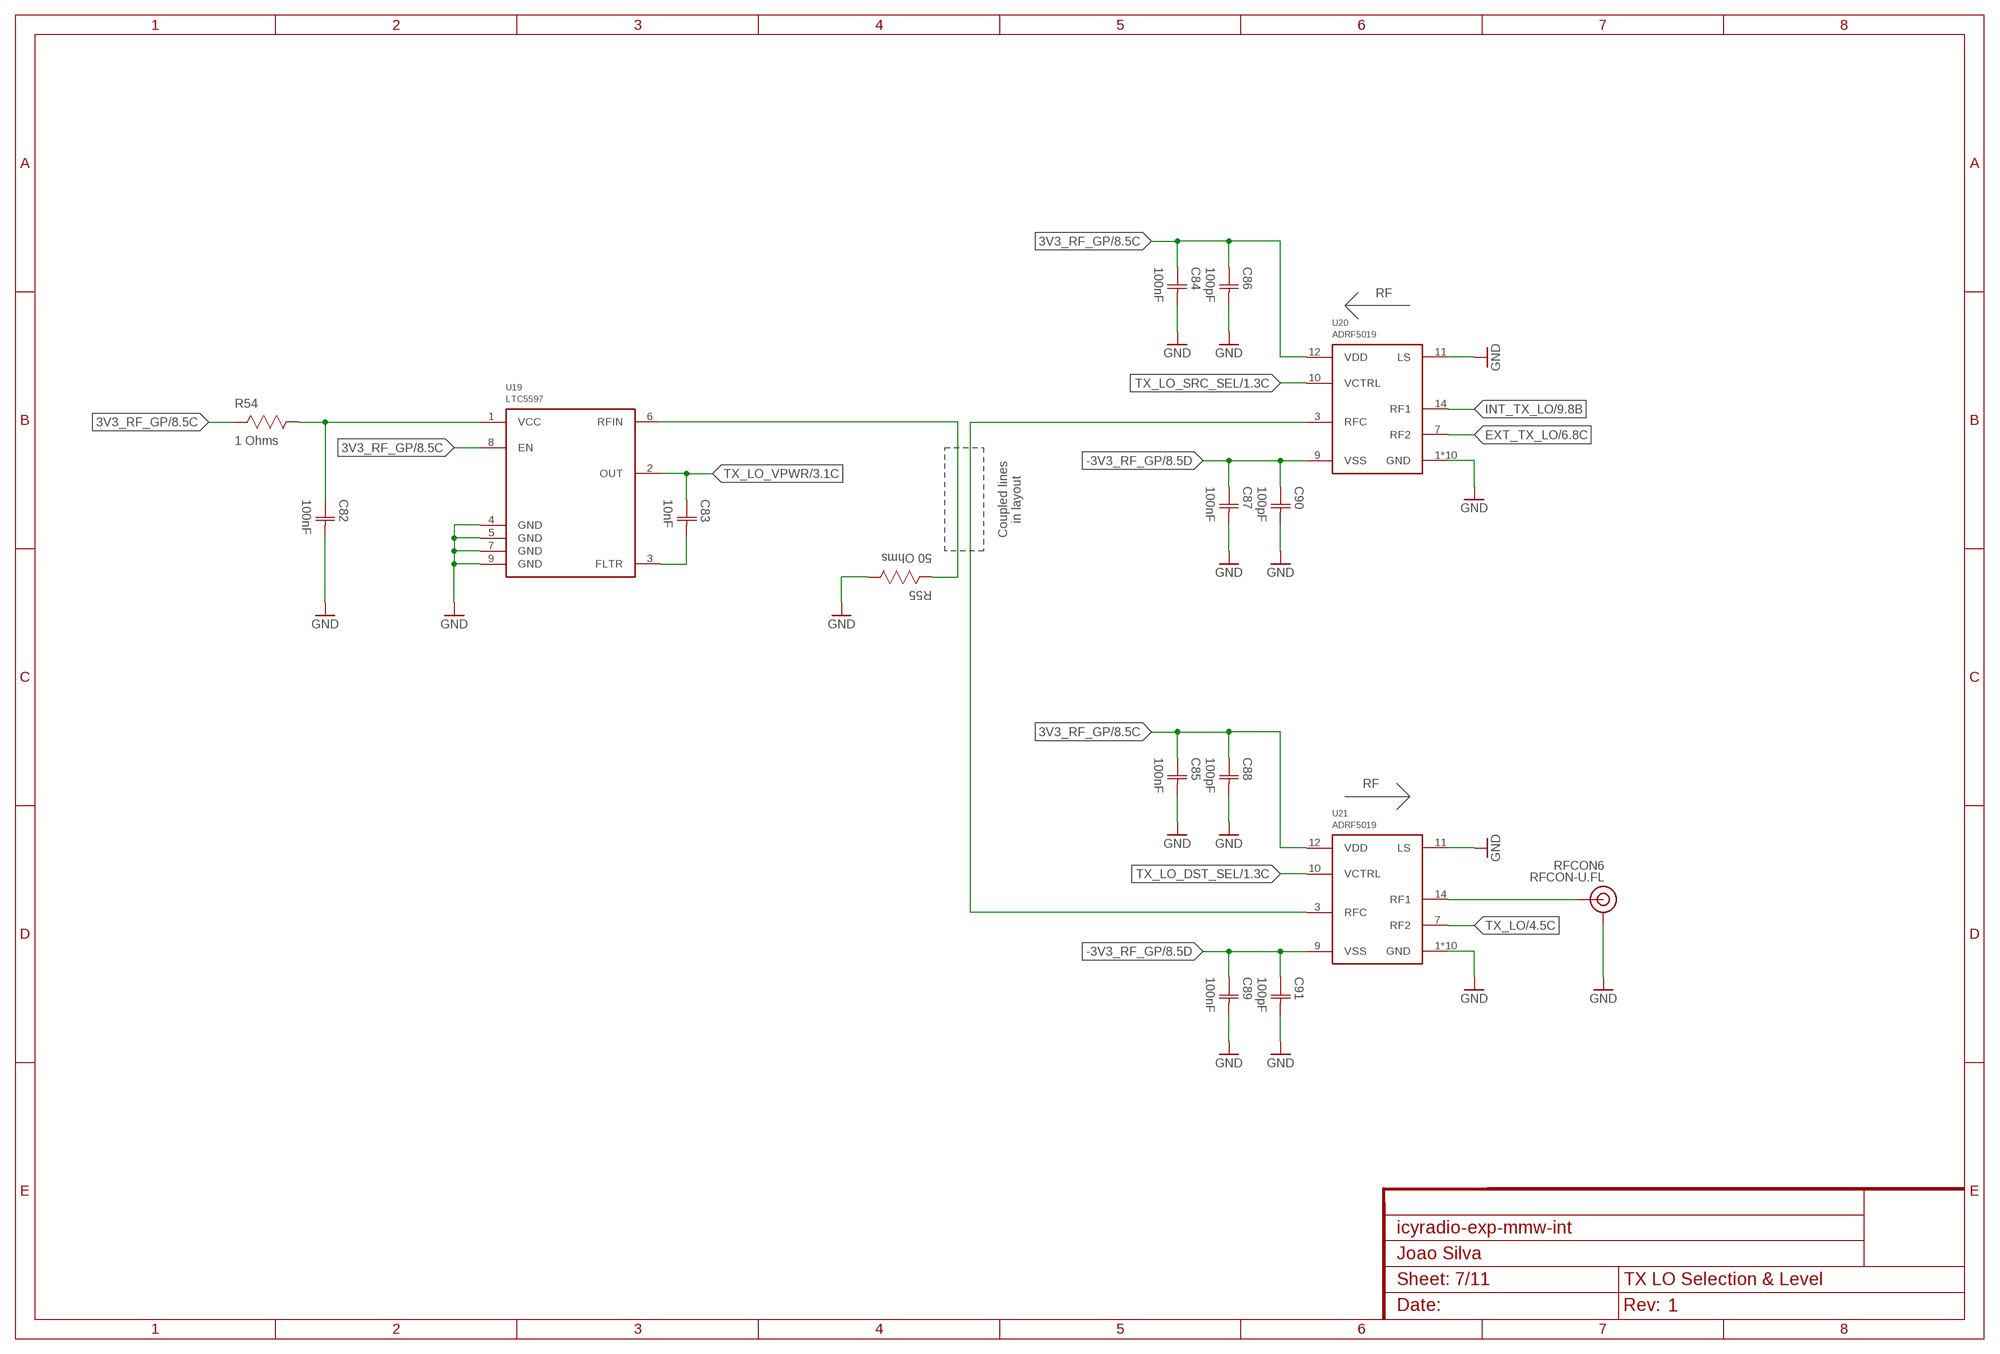
[diagram p6: schematic, sheet 7]

### Parts
C82  100nF  CAPACITOR-0402  [CAP0402]
C83  10nF  CAPACITOR-0402  [CAP0402]
C84  100nF  CAPACITOR-0402  [CAP0402]
C85  100nF  CAPACITOR-0402  [CAP0402]
C86  100pF  CAPACITOR-0402  [CAP0402]
C87  100nF  CAPACITOR-0402  [CAP0402]
C88  100pF  CAPACITOR-0402  [CAP0402]
C89  100nF  CAPACITOR-0402  [CAP0402]
C90  100pF  CAPACITOR-0402  [CAP0402]
C91  100pF  CAPACITOR-0402  [CAP0402]
R54  1 Ohms  RESISTOR-0402  [RES0402]
R55  50 Ohms  RESISTOR-0402  [RES0402]
RFCON6  RFCON-U.FL  [U.FL]
U19  LTC5597  [DFN8_2X2]
U20  ADRF5019  [LFCSP16]
U21  ADRF5019  [LFCSP16]

### Nets
3V3_RF_GP: C84.1(C1) C85.1(C1) C86.1(C1) C88.1(C1) R54.2 U19.8(EN) U20.12(VDD) U21.12(VDD) ; also sheet 6,8,10
-3V3_RF_GP: C87.1(C1) C89.1(C1) C90.1(C1) C91.1(C1) U20.9(VSS) U21.9(VSS) ; also sheet 6,8,10
EXT_TX_LO: U20.7(RF2) ; also sheet 6
GND: C82.2(C2) C84.2(C2) C85.2(C2) C86.2(C2) C87.2(C2) C88.2(C2) C89.2(C2) C90.2(C2) C91.2(C2) R55.1 RFCON6.P$1(GND) RFCON6.P$2(GND) U19.4(GND) U19.5(GND) U19.7(GND) U19.9(GND) U20.1(GND) U20.2(GND) U20.4(GND) U20.5(GND) U20.6(GND) U20.8(GND) U20.11(LS) U20.13(GND) U20.15(GND) U20.16(GND) U20.17(GND) U21.1(GND) U21.2(GND) U21.4(GND) U21.5(GND) U21.6(GND) U21.8(GND) U21.11(LS) U21.13(GND) U21.15(GND) U21.16(GND) U21.17(GND) ; also sheet 1,2,3,4,5,6,8,9,10,11
INT_TX_LO: U20.14(RF1) ; also sheet 9
N$25: C83.2(C2) U19.3(FLTR)
N$32: C82.1(C1) R54.1 U19.1(VCC)
SEL_TX_LO: U20.3(RFC) U21.3(RFC)
TX_LO: U21.7(RF2) ; also sheet 4
TX_LO_DST_SEL: U21.10(VCTRL) ; also sheet 1
TX_LO_MON: RFCON6.P$3(SIGNAL) U21.14(RF1)
TX_LO_SNS: R55.2 U19.6(RFIN)
TX_LO_SRC_SEL: U20.10(VCTRL) ; also sheet 1
TX_LO_VPWR: C83.1(C1) U19.2(OUT) ; also sheet 3

### Notes on the sheet
- RF
- Coupled lines
  in layout
- RF

## Sheet 8 of 11: RX LO Selection & Level
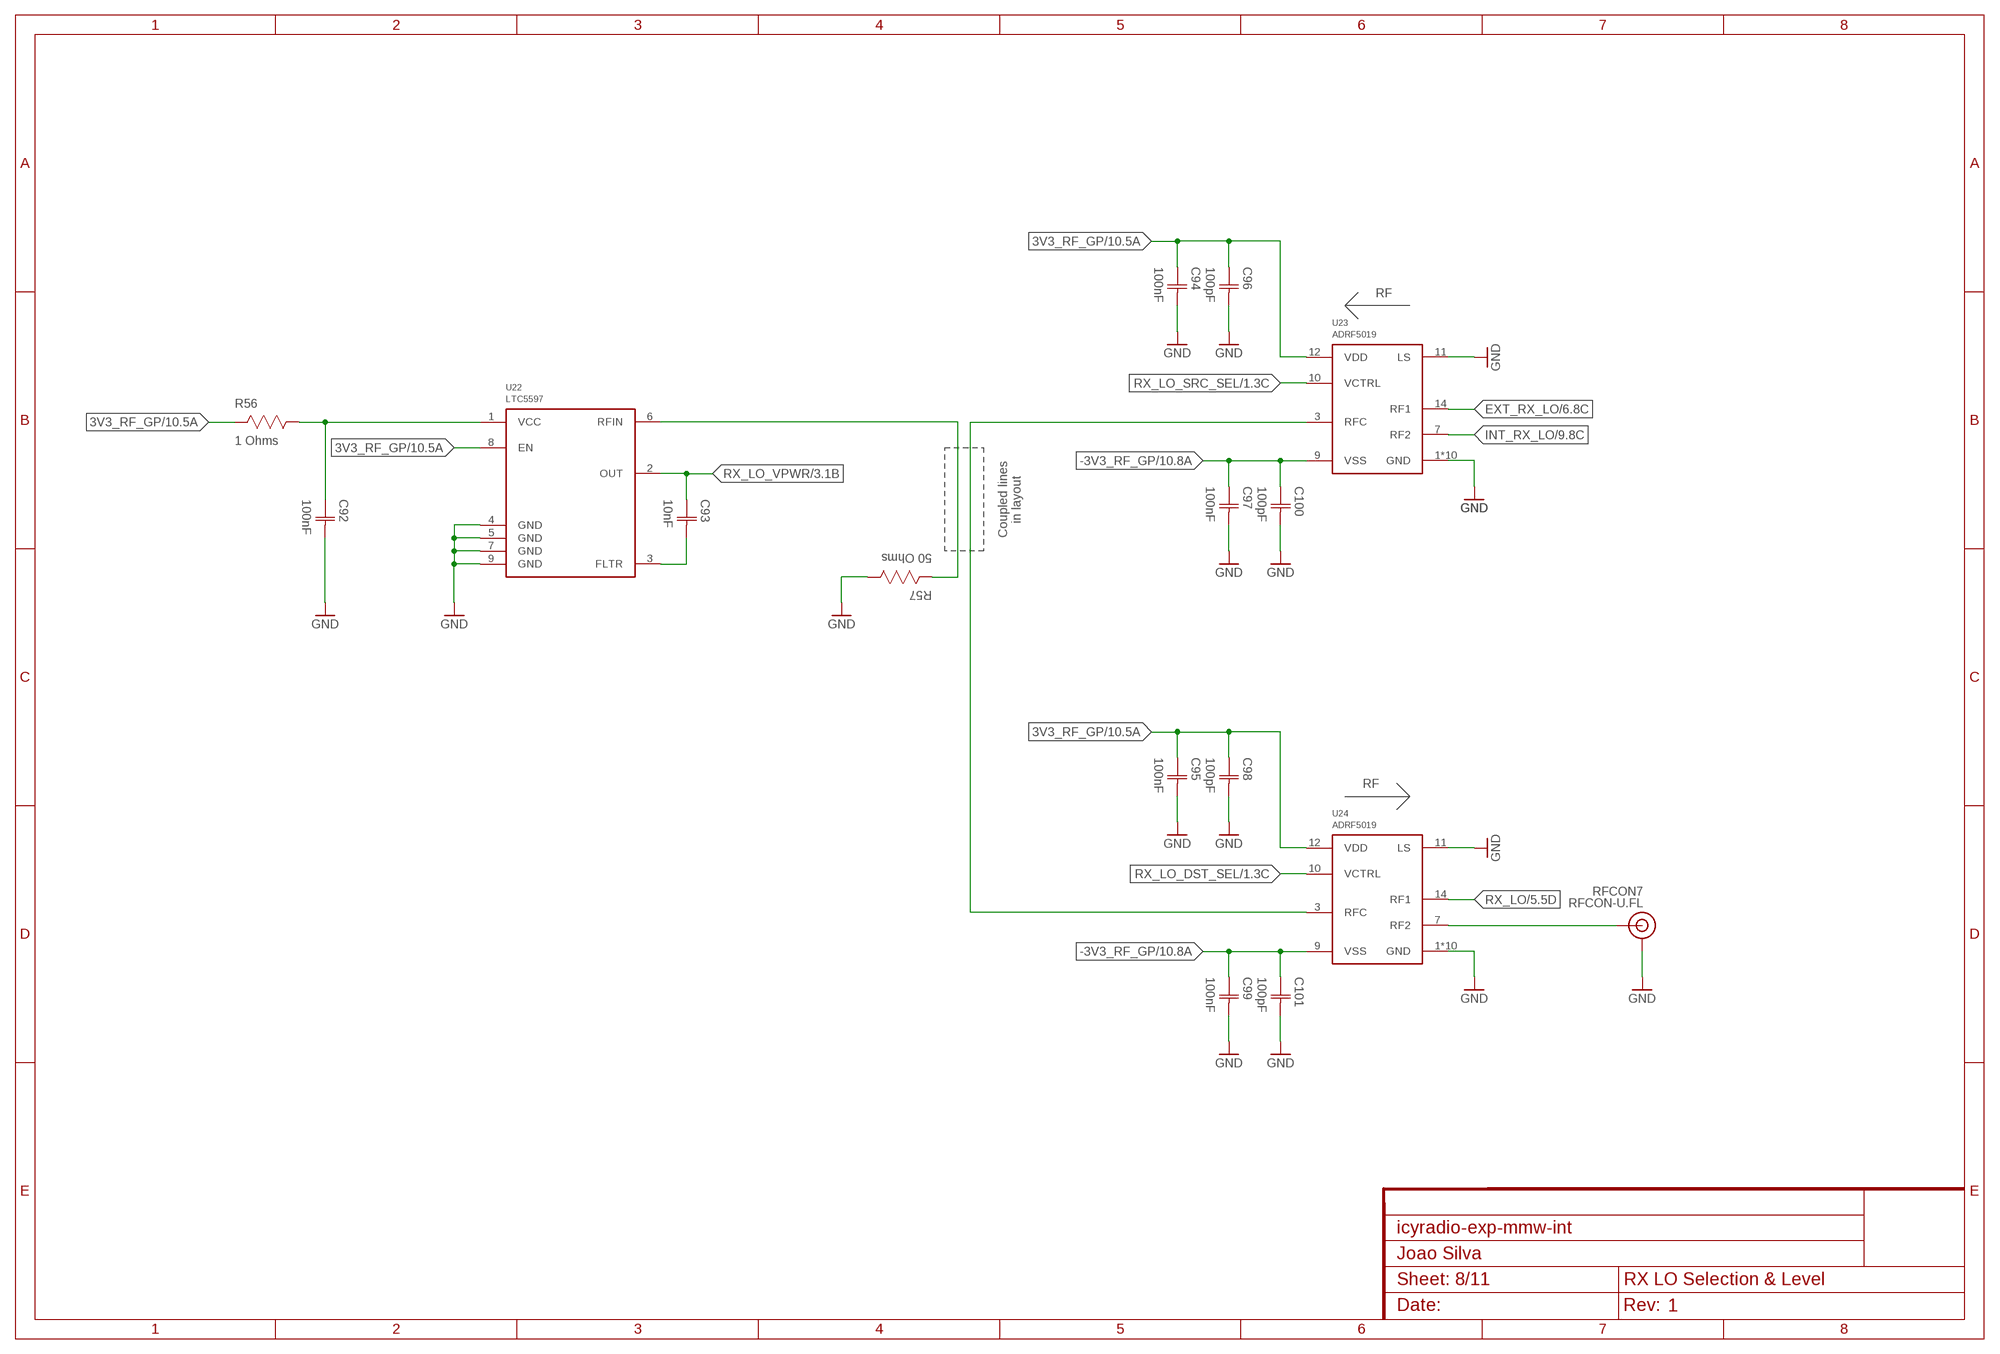
[diagram p7: schematic, sheet 8]

### Parts
C92  100nF  CAPACITOR-0402  [CAP0402]
C93  10nF  CAPACITOR-0402  [CAP0402]
C94  100nF  CAPACITOR-0402  [CAP0402]
C95  100nF  CAPACITOR-0402  [CAP0402]
C96  100pF  CAPACITOR-0402  [CAP0402]
C97  100nF  CAPACITOR-0402  [CAP0402]
C98  100pF  CAPACITOR-0402  [CAP0402]
C99  100nF  CAPACITOR-0402  [CAP0402]
C100  100pF  CAPACITOR-0402  [CAP0402]
C101  100pF  CAPACITOR-0402  [CAP0402]
R56  1 Ohms  RESISTOR-0402  [RES0402]
R57  50 Ohms  RESISTOR-0402  [RES0402]
RFCON7  RFCON-U.FL  [U.FL]
U22  LTC5597  [DFN8_2X2]
U23  ADRF5019  [LFCSP16]
U24  ADRF5019  [LFCSP16]

### Nets
3V3_RF_GP: C94.1(C1) C95.1(C1) C96.1(C1) C98.1(C1) R56.2 U22.8(EN) U23.12(VDD) U24.12(VDD) ; also sheet 6,7,10
-3V3_RF_GP: C97.1(C1) C99.1(C1) C100.1(C1) C101.1(C1) U23.9(VSS) U24.9(VSS) ; also sheet 6,7,10
EXT_RX_LO: U23.14(RF1) ; also sheet 6
GND: C92.2(C2) C94.2(C2) C95.2(C2) C96.2(C2) C97.2(C2) C98.2(C2) C99.2(C2) C100.2(C2) C101.2(C2) R57.1 RFCON7.P$1(GND) RFCON7.P$2(GND) U22.4(GND) U22.5(GND) U22.7(GND) U22.9(GND) U23.1(GND) U23.2(GND) U23.4(GND) U23.5(GND) U23.6(GND) U23.8(GND) U23.11(LS) U23.13(GND) U23.15(GND) U23.16(GND) U23.17(GND) U24.1(GND) U24.2(GND) U24.4(GND) U24.5(GND) U24.6(GND) U24.8(GND) U24.11(LS) U24.13(GND) U24.15(GND) U24.16(GND) U24.17(GND) ; also sheet 1,2,3,4,5,6,7,9,10,11
INT_RX_LO: U23.7(RF2) ; also sheet 9
N$33: C93.2(C2) U22.3(FLTR)
N$34: C92.1(C1) R56.1 U22.1(VCC)
RX_LO: U24.14(RF1) ; also sheet 5
RX_LO_DST_SEL: U24.10(VCTRL) ; also sheet 1
RX_LO_MON: RFCON7.P$3(SIGNAL) U24.7(RF2)
RX_LO_SNS: R57.2 U22.6(RFIN)
RX_LO_SRC_SEL: U23.10(VCTRL) ; also sheet 1
RX_LO_VPWR: C93.1(C1) U22.2(OUT) ; also sheet 3
SEL_RX_LO: U23.3(RFC) U24.3(RFC)

### Notes on the sheet
- RF
- Coupled lines
  in layout
- RF

## Sheet 9 of 11: Synthesizer
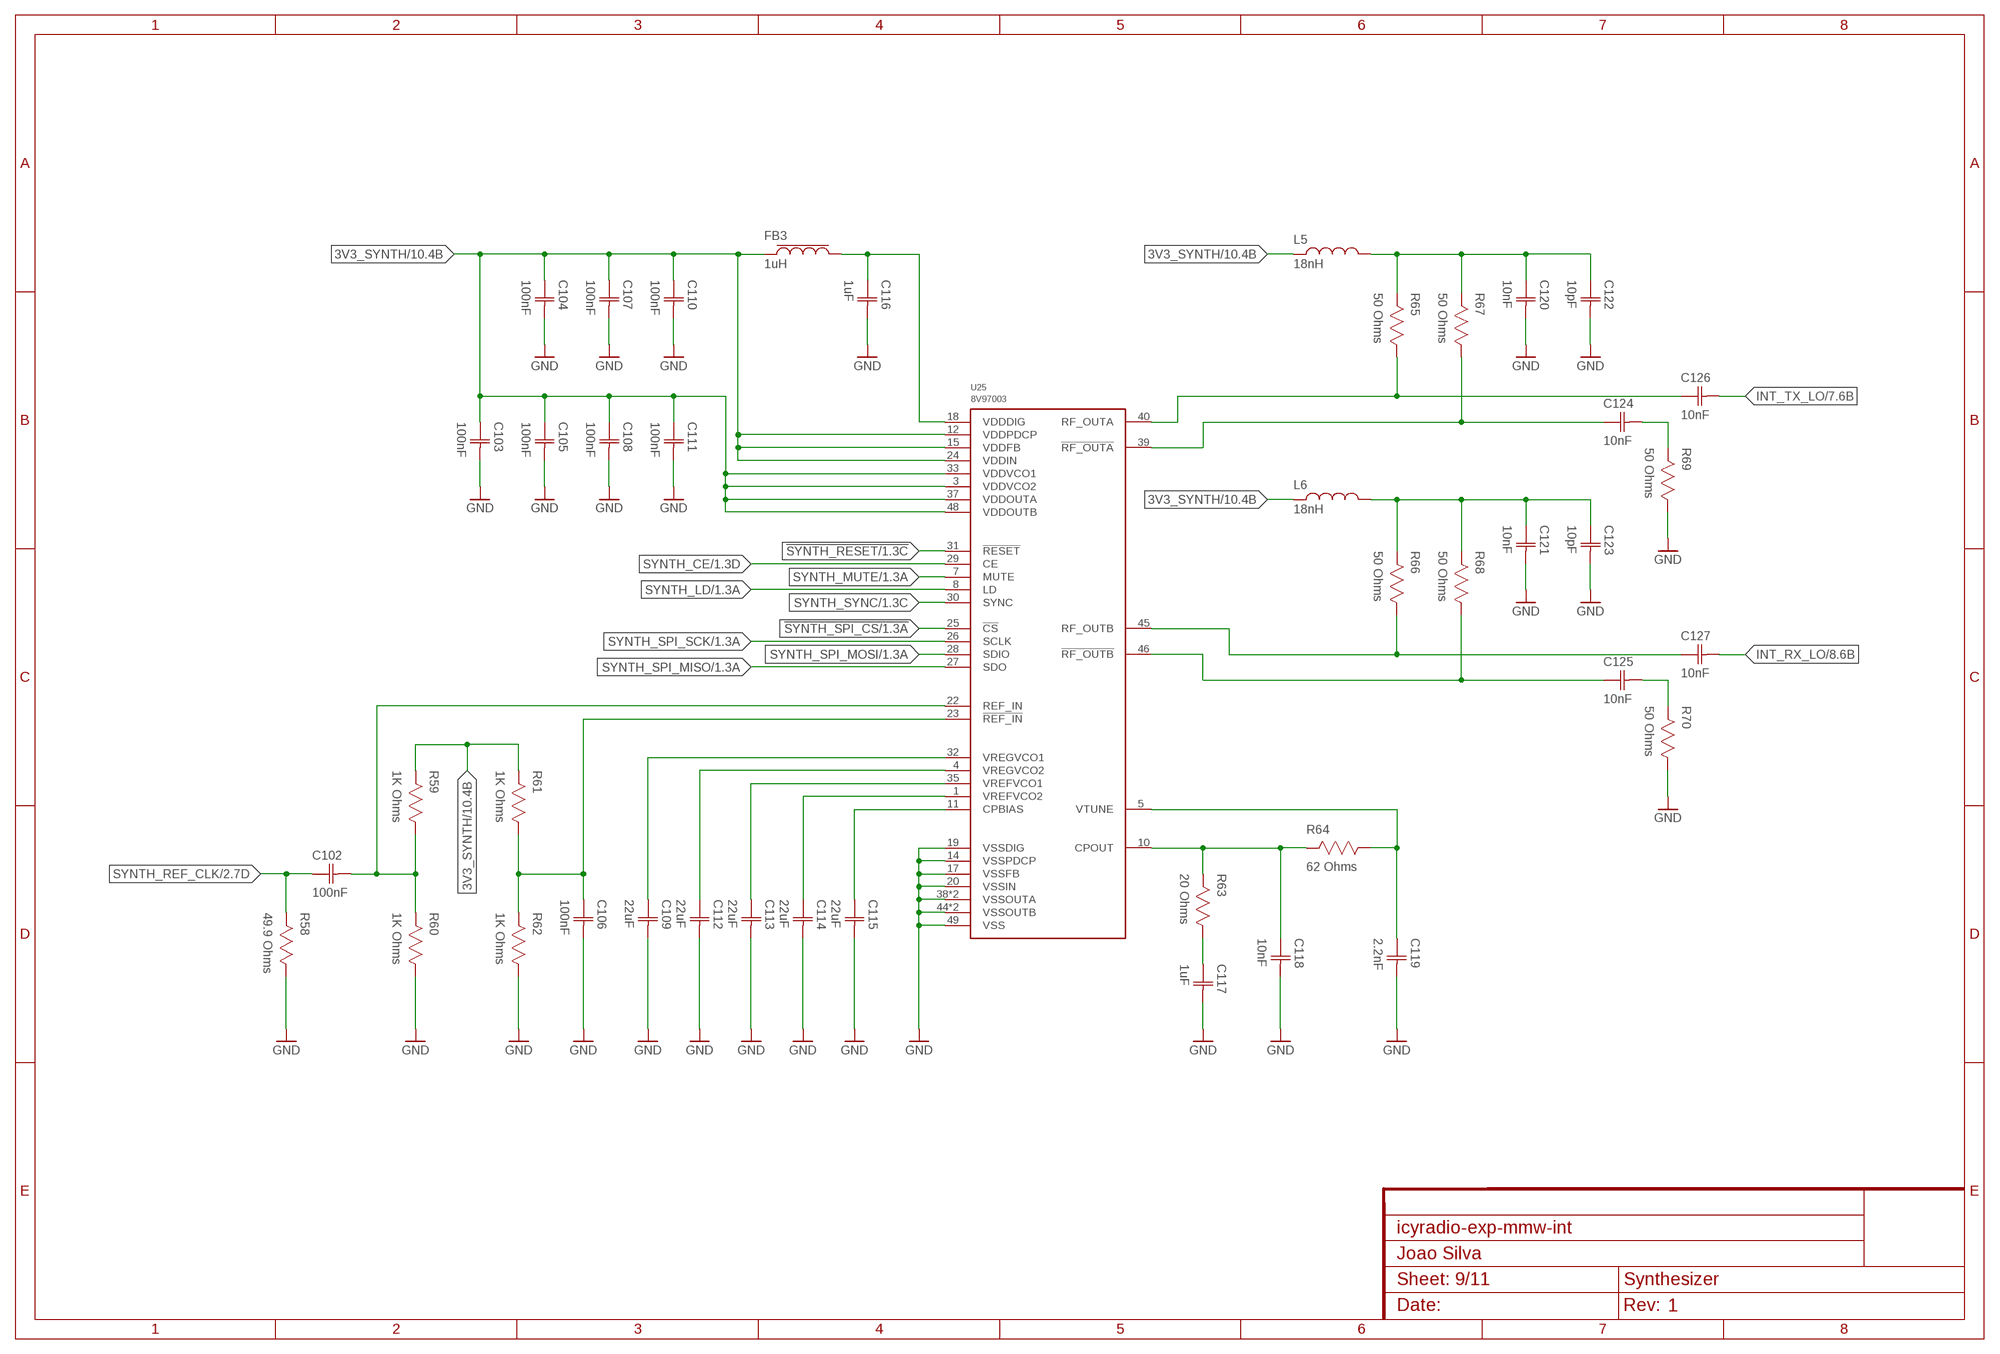
[diagram p8: schematic, sheet 9]

### Parts
C102  100nF  CAPACITOR-0402  [CAP0402]
C103  100nF  CAPACITOR-0402  [CAP0402]
C104  100nF  CAPACITOR-0402  [CAP0402]
C105  100nF  CAPACITOR-0402  [CAP0402]
C106  100nF  CAPACITOR-0402  [CAP0402]
C107  100nF  CAPACITOR-0402  [CAP0402]
C108  100nF  CAPACITOR-0402  [CAP0402]
C109  22uF  CAPACITOR-0402  [CAP0402]
C110  100nF  CAPACITOR-0402  [CAP0402]
C111  100nF  CAPACITOR-0402  [CAP0402]
C112  22uF  CAPACITOR-0402  [CAP0402]
C113  22uF  CAPACITOR-0402  [CAP0402]
C114  22uF  CAPACITOR-0402  [CAP0402]
C115  22uF  CAPACITOR-0402  [CAP0402]
C116  1uF  CAPACITOR-0402  [CAP0402]
C117  1uF  CAPACITOR-0402  [CAP0402]
C118  10nF  CAPACITOR-0402  [CAP0402]
C119  2.2nF  CAPACITOR-0402  [CAP0402]
C120  10nF  CAPACITOR-0402  [CAP0402]
C121  10nF  CAPACITOR-0402  [CAP0402]
C122  10pF  CAPACITOR-0402  [CAP0402]
C123  10pF  CAPACITOR-0402  [CAP0402]
C124  10nF  CAPACITOR-0402  [CAP0402]
C125  10nF  CAPACITOR-0402  [CAP0402]
C126  10nF  CAPACITOR-0402  [CAP0402]
C127  10nF  CAPACITOR-0402  [CAP0402]
FB3  1uH  FERRITE-0603  [IND0603]
L5  18nH  INDUCTOR-0402  [IND0402]
L6  18nH  INDUCTOR-0402  [IND0402]
R58  49.9 Ohms  RESISTOR-0402  [RES0402]
R59  1K Ohms  RESISTOR-0402  [RES0402]
R60  1K Ohms  RESISTOR-0402  [RES0402]
R61  1K Ohms  RESISTOR-0402  [RES0402]
R62  1K Ohms  RESISTOR-0402  [RES0402]
R63  20 Ohms  RESISTOR-0402  [RES0402]
R64  62 Ohms  RESISTOR-0402  [RES0402]
R65  50 Ohms  RESISTOR-0402  [RES0402]
R66  50 Ohms  RESISTOR-0402  [RES0402]
R67  50 Ohms  RESISTOR-0402  [RES0402]
R68  50 Ohms  RESISTOR-0402  [RES0402]
R69  50 Ohms  RESISTOR-0402  [RES0402]
R70  50 Ohms  RESISTOR-0402  [RES0402]
U25  8V97003  [VFQFPN48]

### Nets
3V3_SYNTH: C103.1(C1) C104.1(C1) C105.1(C1) C107.1(C1) C108.1(C1) C110.1(C1) C111.1(C1) FB3.1 L5.1 L6.1 R59.2 R61.2 U25.3(VDDVCO2) U25.12(VDDPDCP) U25.15(VDDFB) U25.24(VDDIN) U25.33(VDDVCO1) U25.37(VDDOUTA) U25.48(VDDOUTB) ; also sheet 10
!SYNTH_RESET: U25.31(!RESET) ; also sheet 1
!SYNTH_SPI_CS: U25.25(!CS) ; also sheet 1
GND: C103.2(C2) C104.2(C2) C105.2(C2) C106.2(C2) C107.2(C2) C108.2(C2) C109.2(C2) C110.2(C2) C111.2(C2) C112.2(C2) C113.2(C2) C114.2(C2) C115.2(C2) C116.2(C2) C117.2(C2) C118.2(C2) C119.2(C2) C120.2(C2) C121.2(C2) C122.2(C2) C123.2(C2) R58.1 R60.1 R62.1 R69.1 R70.1 U25.14(VSSPDCP) U25.17(VSSFB) U25.19(VSSDIG) U25.20(VSSIN) U25.38(VSSOUTA) U25.41(VSSOUTA) U25.44(VSSOUTB) U25.47(VSSOUTB) U25.49(VSS) ; also sheet 1,2,3,4,5,6,7,8,10,11
INT_RX_LO: C127.2(C2) ; also sheet 8
INT_TX_LO: C126.2(C2) ; also sheet 7
N$101: C117.1(C1) R63.1
SYNTH_CE: U25.29(CE) ; also sheet 1
SYNTH_CPBIAS: C115.1(C1) U25.11(CPBIAS)
SYNTH_CPOUT: C118.1(C1) R63.2 R64.2 U25.10(CPOUT)
SYNTH_LD: U25.8(LD) ; also sheet 1
SYNTH_MUTE: U25.7(MUTE) ; also sheet 1
SYNTH_REF_CLK: C102.1(C1) R58.2 ; also sheet 2
SYNTH_REFIN_N: C106.1(C1) R61.1 R62.2 U25.23(!REF_IN)
SYNTH_REFIN_P: C102.2(C2) R59.1 R60.2 U25.22(REF_IN)
SYNTH_RFOUTA_ACC_N: C124.2(C2) R69.2
SYNTH_RFOUTA_BIAS: C120.1(C1) C122.1(C1) L5.2 R65.2 R67.2
SYNTH_RFOUTA_N [Microstrip Diff Z50]: C124.1(C1) R67.1 U25.39(!RF_OUTA)
SYNTH_RFOUTA_P [Microstrip Diff Z50]: C126.1(C1) R65.1 U25.40(RF_OUTA)
SYNTH_RFOUTB_ACC_N: C125.2(C2) R70.2
SYNTH_RFOUTB_BIAS: C121.1(C1) C123.1(C1) L6.2 R66.2 R68.2
SYNTH_RFOUTB_N [Microstrip Diff Z50]: C125.1(C1) R68.1 U25.46(!RF_OUTB)
SYNTH_RFOUTB_P [Microstrip Diff Z50]: C127.1(C1) R66.1 U25.45(RF_OUTB)
SYNTH_SPI_MISO: U25.27(SDO) ; also sheet 1
SYNTH_SPI_MOSI: U25.28(SDIO) ; also sheet 1
SYNTH_SPI_SCK: U25.26(SCLK) ; also sheet 1
SYNTH_SYNC: U25.30(SYNC) ; also sheet 1,2
SYNTH_VDDDIG: C116.1(C1) FB3.2 U25.18(VDDDIG)
SYNTH_VREFVCO1: C113.1(C1) U25.35(VREFVCO1)
SYNTH_VREFVCO2: C114.1(C1) U25.1(VREFVCO2)
SYNTH_VREGVCO1: C109.1(C1) U25.32(VREGVCO1)
SYNTH_VREGVCO2: C112.1(C1) U25.4(VREGVCO2)
SYNTH_VTUNE: C119.1(C1) R64.1 U25.5(VTUNE)

## Sheet 10 of 11: Power
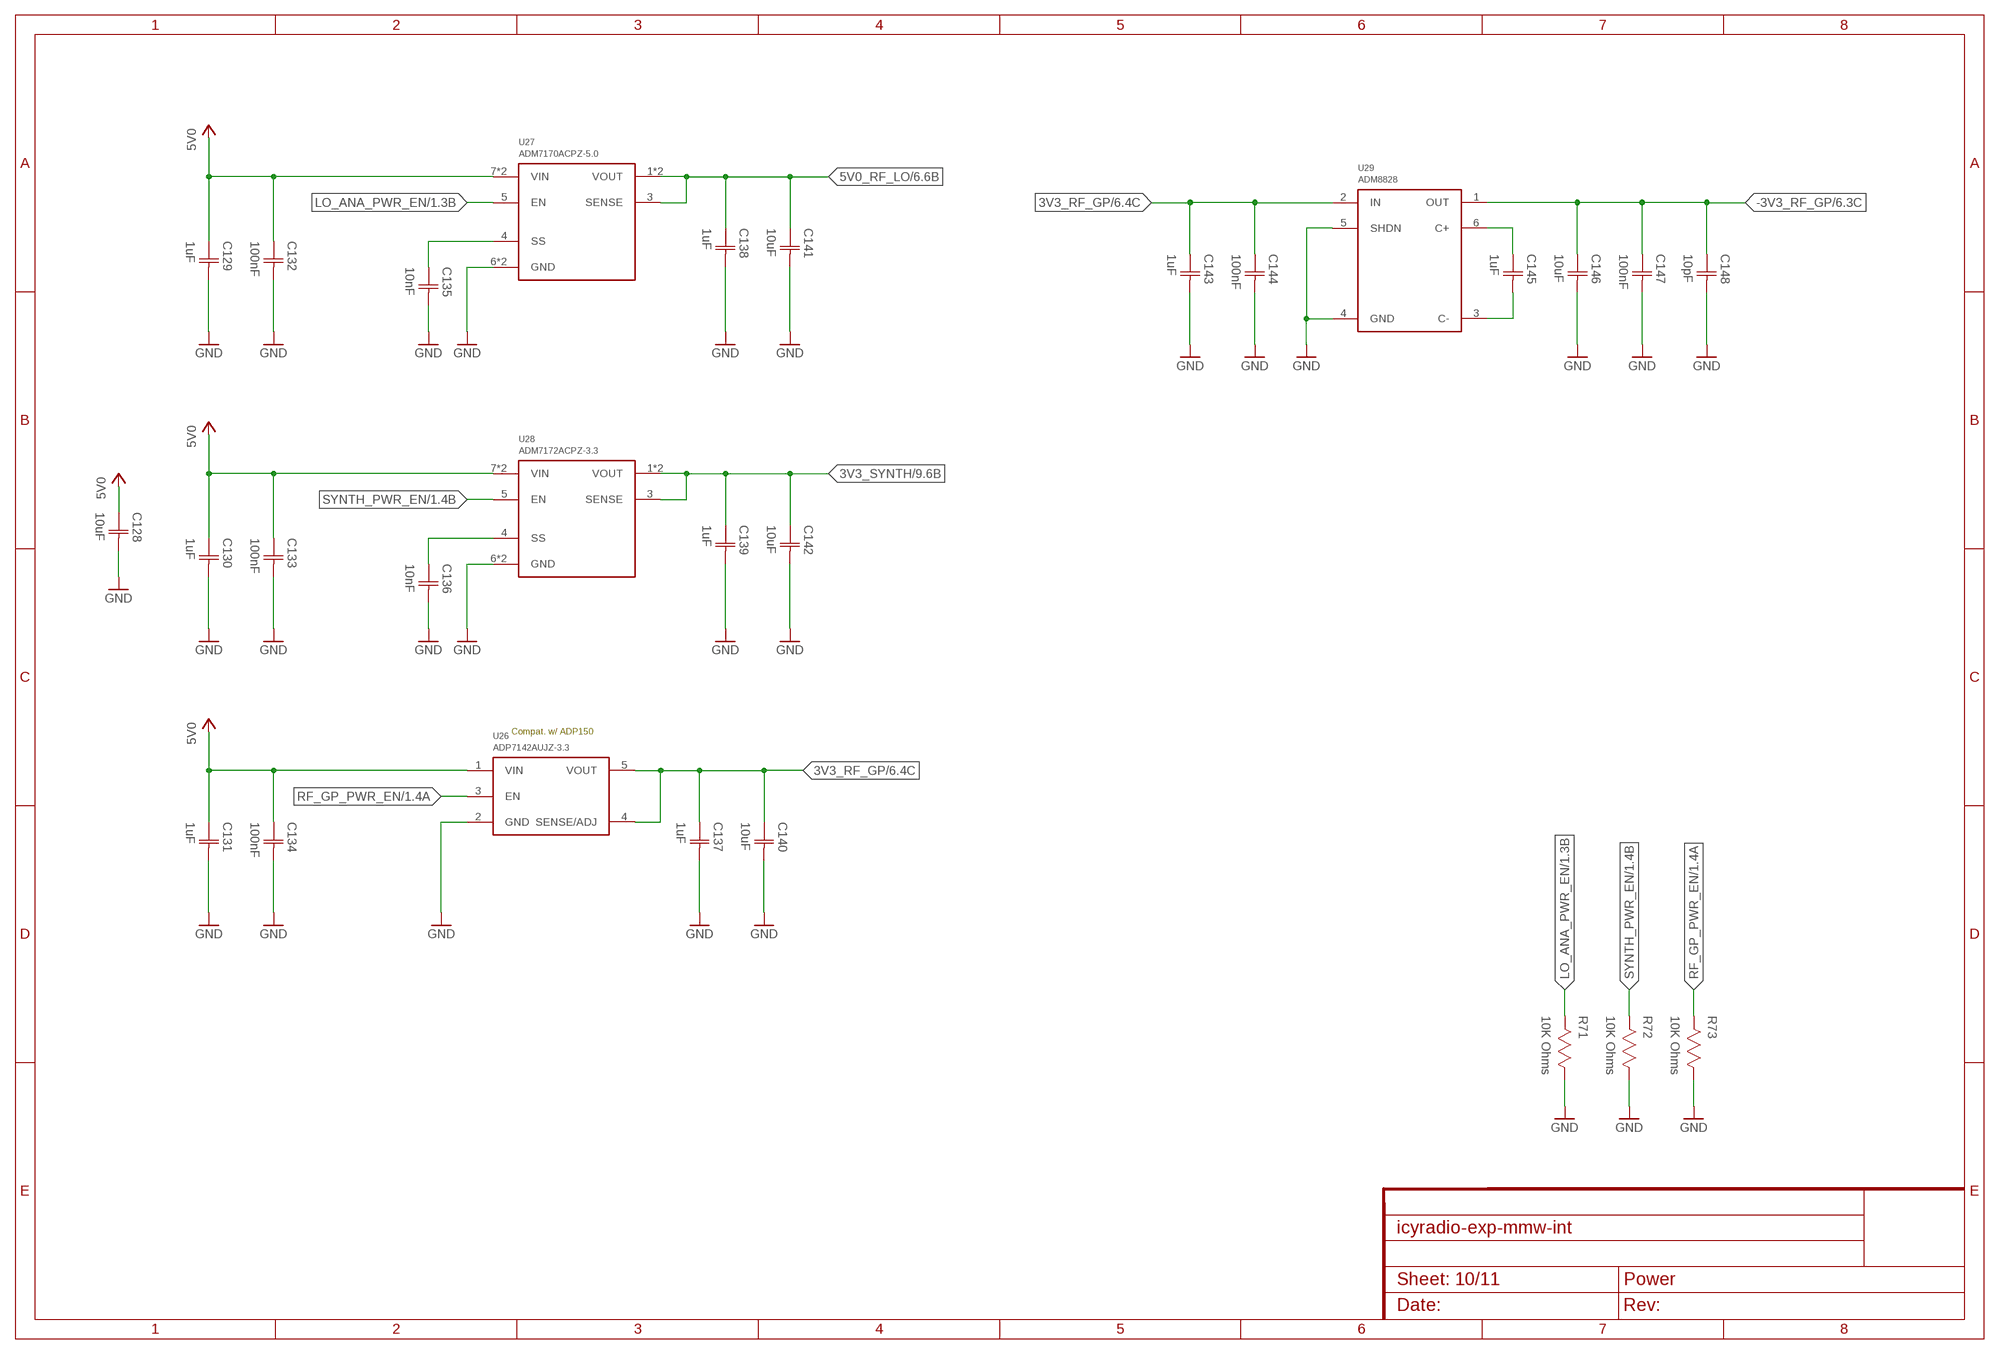
[diagram p9: schematic, sheet 10]

### Parts
C128  10uF  CAPACITOR-0603  [CAP0603]
C129  1uF  CAPACITOR-0402  [CAP0402]
C130  1uF  CAPACITOR-0402  [CAP0402]
C131  1uF  CAPACITOR-0402  [CAP0402]
C132  100nF  CAPACITOR-0402  [CAP0402]
C133  100nF  CAPACITOR-0402  [CAP0402]
C134  100nF  CAPACITOR-0402  [CAP0402]
C135  10nF  CAPACITOR-0402  [CAP0402]
C136  10nF  CAPACITOR-0402  [CAP0402]
C137  1uF  CAPACITOR-0402  [CAP0402]
C138  1uF  CAPACITOR-0402  [CAP0402]
C139  1uF  CAPACITOR-0402  [CAP0402]
C140  10uF  CAPACITOR-0402  [CAP0402]
C141  10uF  CAPACITOR-0402  [CAP0402]
C142  10uF  CAPACITOR-0402  [CAP0402]
C143  1uF  CAPACITOR-0402  [CAP0402]
C144  100nF  CAPACITOR-0402  [CAP0402]
C145  1uF  CAPACITOR-0402  [CAP0402]
C146  10uF  CAPACITOR-0402  [CAP0402]
C147  100nF  CAPACITOR-0402  [CAP0402]
C148  10pF  CAPACITOR-0402  [CAP0402]
R71  10K Ohms  RESISTOR-0402  [RES0402]
R72  10K Ohms  RESISTOR-0402  [RES0402]
R73  10K Ohms  RESISTOR-0402  [RES0402]
U26  ADP7142AUJZ-3.3  [SOT23-5]
U27  ADM7170ACPZ-5.0  [LFCSP8_3X3]
U28  ADM7172ACPZ-3.3  [LFCSP8_3X3]
U29  ADM8828  [SOT23-6]

### Nets
3V3_RF_GP: C137.1(C1) C140.1(C1) C143.1(C1) C144.1(C1) U26.4(SENSE/ADJ) U26.5(VOUT) U29.2(IN) ; also sheet 6,7,8
3V3_SYNTH: C139.1(C1) C142.1(C1) U28.1(VOUT) U28.2(VOUT) U28.3(SENSE) ; also sheet 9
5V0: C128.1(C1) C129.1(C1) C130.1(C1) C131.1(C1) C132.1(C1) C133.1(C1) C134.1(C1) U26.1(VIN) U27.7(VIN) U27.8(VIN) U28.7(VIN) U28.8(VIN) ; also sheet 11
5V0_RF_LO: C138.1(C1) C141.1(C1) U27.1(VOUT) U27.2(VOUT) U27.3(SENSE) ; also sheet 6
-3V3_RF_GP: C146.1(C1) C147.1(C1) C148.1(C1) U29.1(OUT) ; also sheet 6,7,8
GND: C128.2(C2) C129.2(C2) C130.2(C2) C131.2(C2) C132.2(C2) C133.2(C2) C134.2(C2) C135.2(C2) C136.2(C2) C137.2(C2) C138.2(C2) C139.2(C2) C140.2(C2) C141.2(C2) C142.2(C2) C143.2(C2) C144.2(C2) C146.2(C2) C147.2(C2) C148.2(C2) R71.1 R72.1 R73.1 U26.2(GND) U27.6(GND) U27.9(GND) U28.6(GND) U28.9(GND) U29.4(GND) U29.5(SHDN) ; also sheet 1,2,3,4,5,6,7,8,9,11
LO_ANA_PWR_EN: R71.2 U27.5(EN) ; also sheet 1
N$3: C135.1(C1) U27.4(SS)
N$28: C136.1(C1) U28.4(SS)
N$29: C145.1(C1) U29.6(C+)
N$30: C145.2(C2) U29.3(C-)
RF_GP_PWR_EN: R73.2 U26.3(EN) ; also sheet 1
SYNTH_PWR_EN: R72.2 U28.5(EN) ; also sheet 1

### Notes on the sheet
- Compat. w/ ADP150

## Sheet 11 of 11: Power
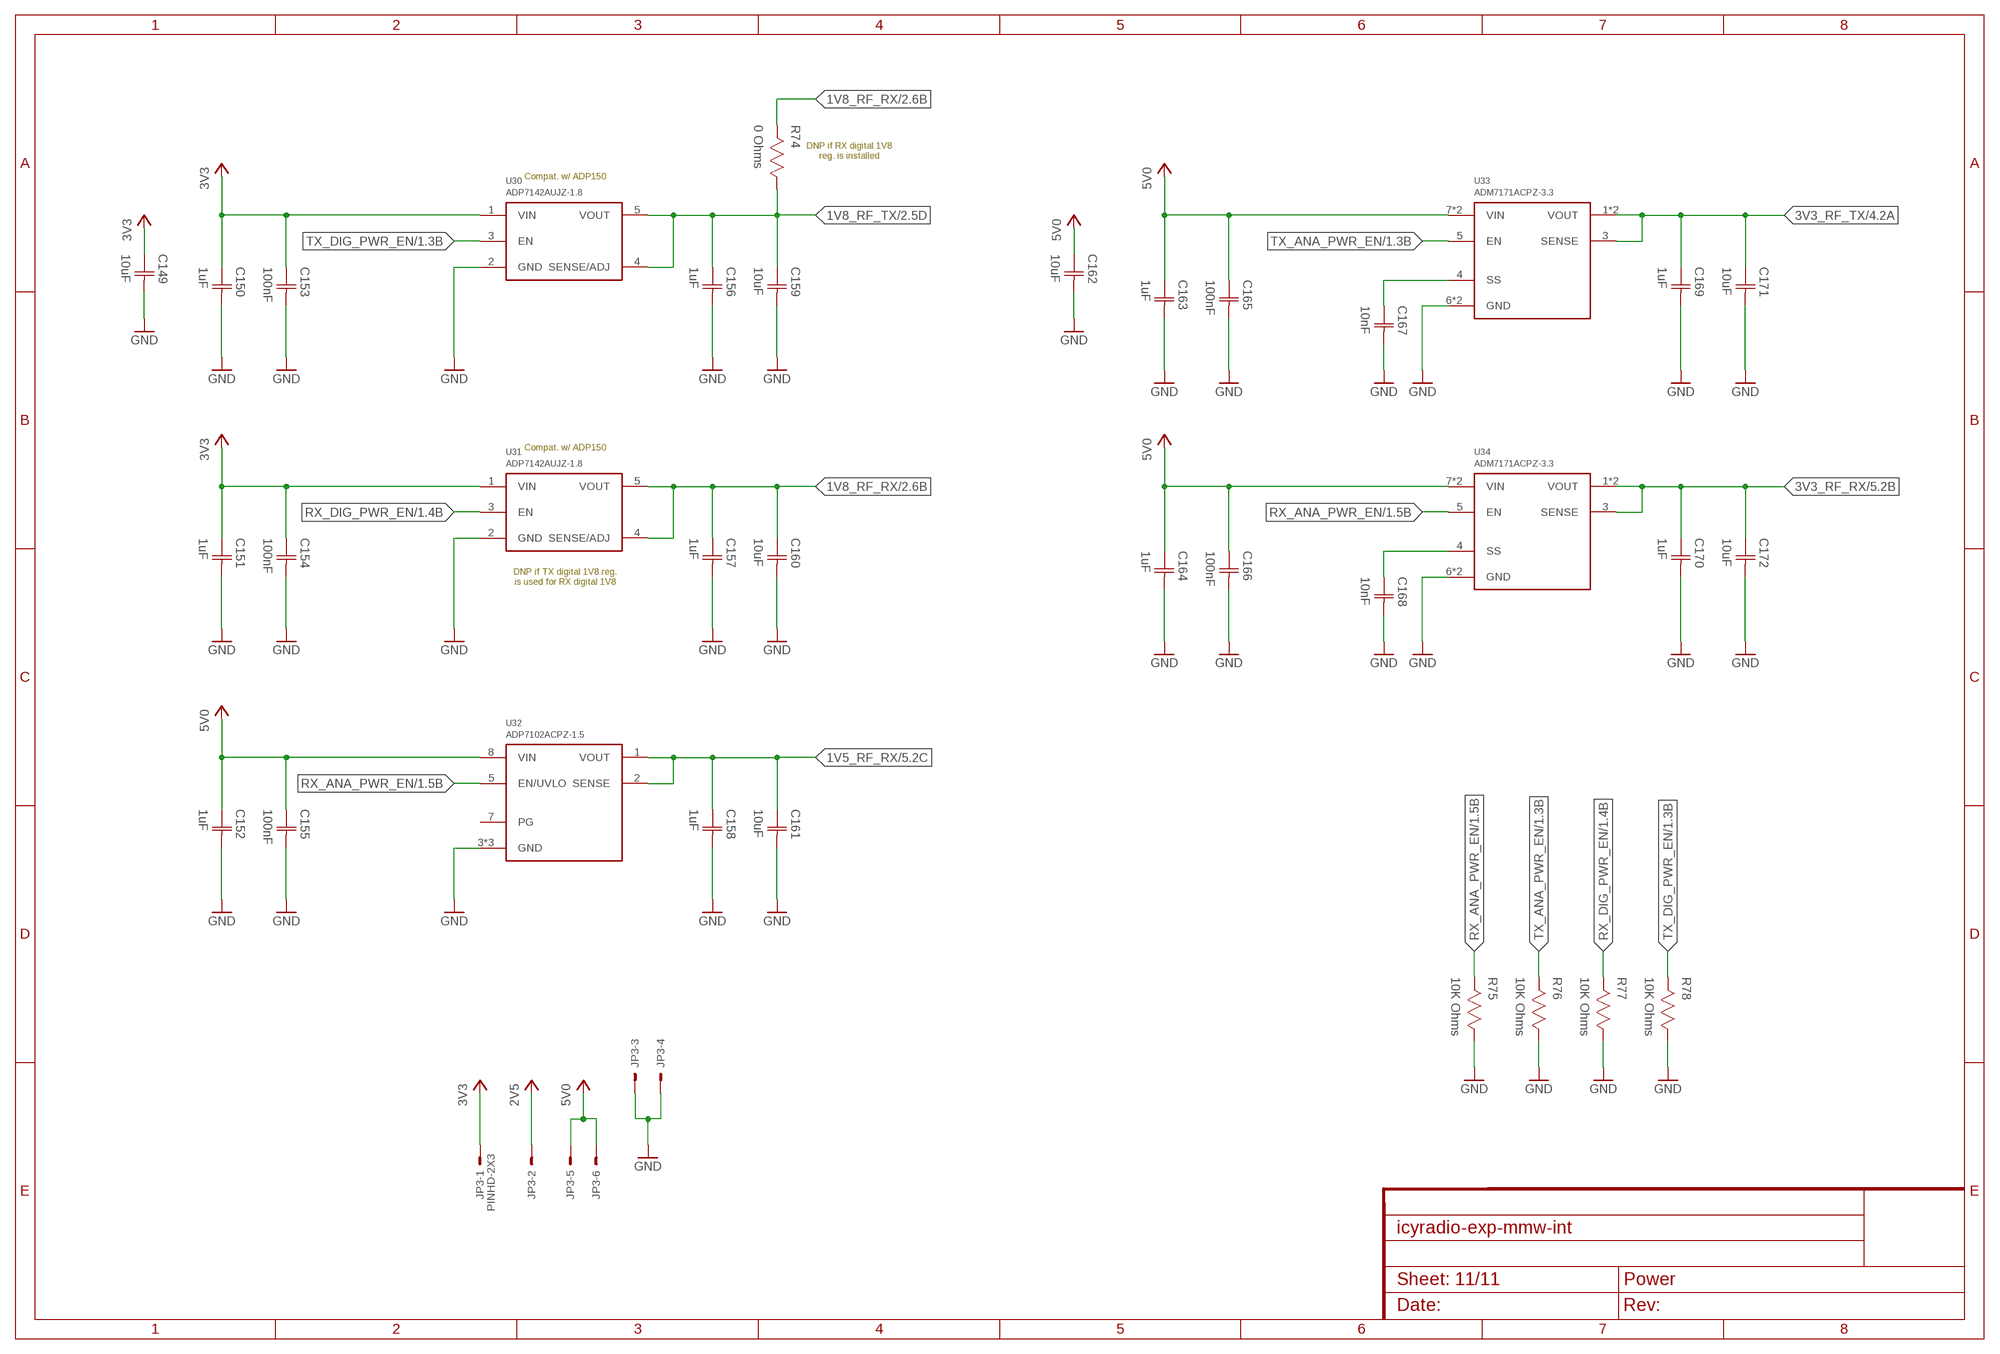
[diagram p10: schematic, sheet 11]

### Parts
C149  10uF  CAPACITOR-0603  [CAP0603]
C150  1uF  CAPACITOR-0402  [CAP0402]
C151  1uF  CAPACITOR-0402  [CAP0402]
C152  1uF  CAPACITOR-0402  [CAP0402]
C153  100nF  CAPACITOR-0402  [CAP0402]
C154  100nF  CAPACITOR-0402  [CAP0402]
C155  100nF  CAPACITOR-0402  [CAP0402]
C156  1uF  CAPACITOR-0402  [CAP0402]
C157  1uF  CAPACITOR-0402  [CAP0402]
C158  1uF  CAPACITOR-0402  [CAP0402]
C159  10uF  CAPACITOR-0402  [CAP0402]
C160  10uF  CAPACITOR-0402  [CAP0402]
C161  10uF  CAPACITOR-0402  [CAP0402]
C162  10uF  CAPACITOR-0603  [CAP0603]
C163  1uF  CAPACITOR-0402  [CAP0402]
C164  1uF  CAPACITOR-0402  [CAP0402]
C165  100nF  CAPACITOR-0402  [CAP0402]
C166  100nF  CAPACITOR-0402  [CAP0402]
C167  10nF  CAPACITOR-0402  [CAP0402]
C168  10nF  CAPACITOR-0402  [CAP0402]
C169  1uF  CAPACITOR-0402  [CAP0402]
C170  1uF  CAPACITOR-0402  [CAP0402]
C171  10uF  CAPACITOR-0402  [CAP0402]
C172  10uF  CAPACITOR-0402  [CAP0402]
JP3  PINHD-2X3  [2X03]
R74  0 Ohms  RESISTOR-0402  [RES0402]
R75  10K Ohms  RESISTOR-0402  [RES0402]
R76  10K Ohms  RESISTOR-0402  [RES0402]
R77  10K Ohms  RESISTOR-0402  [RES0402]
R78  10K Ohms  RESISTOR-0402  [RES0402]
U30  ADP7142AUJZ-1.8  [SOT23-5]
U31  ADP7142AUJZ-1.8  [SOT23-5]
U32  ADP7102ACPZ-1.5  [LFCSP8_3X3]
U33  ADM7171ACPZ-3.3  [LFCSP8_3X3]
U34  ADM7171ACPZ-3.3  [LFCSP8_3X3]

### Nets
1V5_RF_RX: C158.1(C1) C161.1(C1) U32.1(VOUT) U32.2(SENSE) ; also sheet 5
1V8_RF_RX: C157.1(C1) C160.1(C1) R74.2 U31.4(SENSE/ADJ) U31.5(VOUT) ; also sheet 2,5
1V8_RF_TX: C156.1(C1) C159.1(C1) R74.1 U30.4(SENSE/ADJ) U30.5(VOUT) ; also sheet 2,4
2V5: JP3.2
3V3: C149.1(C1) C150.1(C1) C151.1(C1) C153.1(C1) C154.1(C1) JP3.1 U30.1(VIN) U31.1(VIN) ; also sheet 1,2,3
3V3_RF_RX: C170.1(C1) C172.1(C1) U34.1(VOUT) U34.2(VOUT) U34.3(SENSE) ; also sheet 5
3V3_RF_TX: C169.1(C1) C171.1(C1) U33.1(VOUT) U33.2(VOUT) U33.3(SENSE) ; also sheet 4
5V0: C152.1(C1) C155.1(C1) C162.1(C1) C163.1(C1) C164.1(C1) C165.1(C1) C166.1(C1) JP3.5 JP3.6 U32.8(VIN) U33.7(VIN) U33.8(VIN) U34.7(VIN) U34.8(VIN) ; also sheet 10
GND: C149.2(C2) C150.2(C2) C151.2(C2) C152.2(C2) C153.2(C2) C154.2(C2) C155.2(C2) C156.2(C2) C157.2(C2) C158.2(C2) C159.2(C2) C160.2(C2) C161.2(C2) C162.2(C2) C163.2(C2) C164.2(C2) C165.2(C2) C166.2(C2) C167.2(C2) C168.2(C2) C169.2(C2) C170.2(C2) C171.2(C2) C172.2(C2) JP3.3 JP3.4 R75.1 R76.1 R77.1 R78.1 U30.2(GND) U31.2(GND) U32.3(GND) U32.6(GND) U32.9(GND) U33.6(GND) U33.9(GND) U34.6(GND) U34.9(GND) ; also sheet 1,2,3,4,5,6,7,8,9,10
N$2: C168.1(C1) U34.4(SS)
N$96: C167.1(C1) U33.4(SS)
RX_ANA_PWR_EN: R75.2 U32.5(EN/UVLO) U34.5(EN) ; also sheet 1
RX_DIG_PWR_EN: R77.2 U31.3(EN) ; also sheet 1
TX_ANA_PWR_EN: R76.2 U33.5(EN) ; also sheet 1
TX_DIG_PWR_EN: R78.2 U30.3(EN) ; also sheet 1
Unconnected: U32.7(PG)

### Notes on the sheet
- DNP if RX digital 1V8
  reg. is installed
- Compat. w/ ADP150
- Compat. w/ ADP150
- DNP if TX digital 1V8 reg.
  is used for RX digital 1V8

## Library data of the parts
C1-C69 C71 C74-C77 C79 C82-C119 C122 C123 C128-C172 = Capacitor:CAPACITOR
C70 C72 C73 C78 C80 C81 = Capacitor:CAPACITOR; SERIES: ATC600L
C120 C121 C124-C127 = Capacitor:CAPACITOR; SERIES: ATC520L
D1 = LED:LED; COLOR: RED
D2 = LED:LED; COLOR: BLUE
FB1-FB3 = Inductor:FERRITE
JP1-JP3 = Pin Header:PINHD-2X3: PIN HEADER
L1-L4 = Inductor:INDUCTOR; SERIES: 0402DC
L5 L6 = Inductor:INDUCTOR
LOGO1 = Silkscreen:JS
Q1 Q2 = Alpha Omega:AO3400
R1-R39 R41-R44 R47 R49 R50 R54 R56 R58-R64 R71-R78 = Resistor:RESISTOR
R40 R45 R46 R48 R51-R53 R55 R57 R65-R70 = Resistor:RESISTOR; SERIES: FC0402
RFCON1-RFCON7 = RF Connector:RFCON
TC1 = TagConnect:TC2050-IDC
U1 = EFM32:EFM32GG11B4*Q64
U2-U4 = Microchip:MCP9802-A*
U5 U6 = ON Semiconductor:FXL4TD245
U7 U9 = Microchip:MCP6V32
U8 = Microchip:MCP4728-A*
U10 U13 = Mini Circuits:BFCV-*+
U11 U14 = Mini Circuits:QCN-34*+
U12 = Analog Devices:ADMV1013
U15 = Analog Devices:ADMV1014
U16 U18 = Mini Circuits:PMA2-123LN+
U17 = Analog Devices:ADRF5720
U19 U22 = Analog Devices:LTC5597
U20 U21 U23 U24 = Analog Devices:ADRF5019
U25 = Renesas:8V97003
U26 U30 U31 = Analog Devices:ADP7142AUJZ*
U27 = Analog Devices:ADM7170ACPZ
U28 = Analog Devices:ADM7172ACPZ
U29 = Analog Devices:ADM8828
U32 = Analog Devices:ADP7102ACPZ
U33 U34 = Analog Devices:ADM7171ACPZ

## Net classes
1 Microstrip Diff Z50: width 0.254 mm, clearance 0.15 mm